# EAGLE schematic silense (EAGLE 9.5.1)
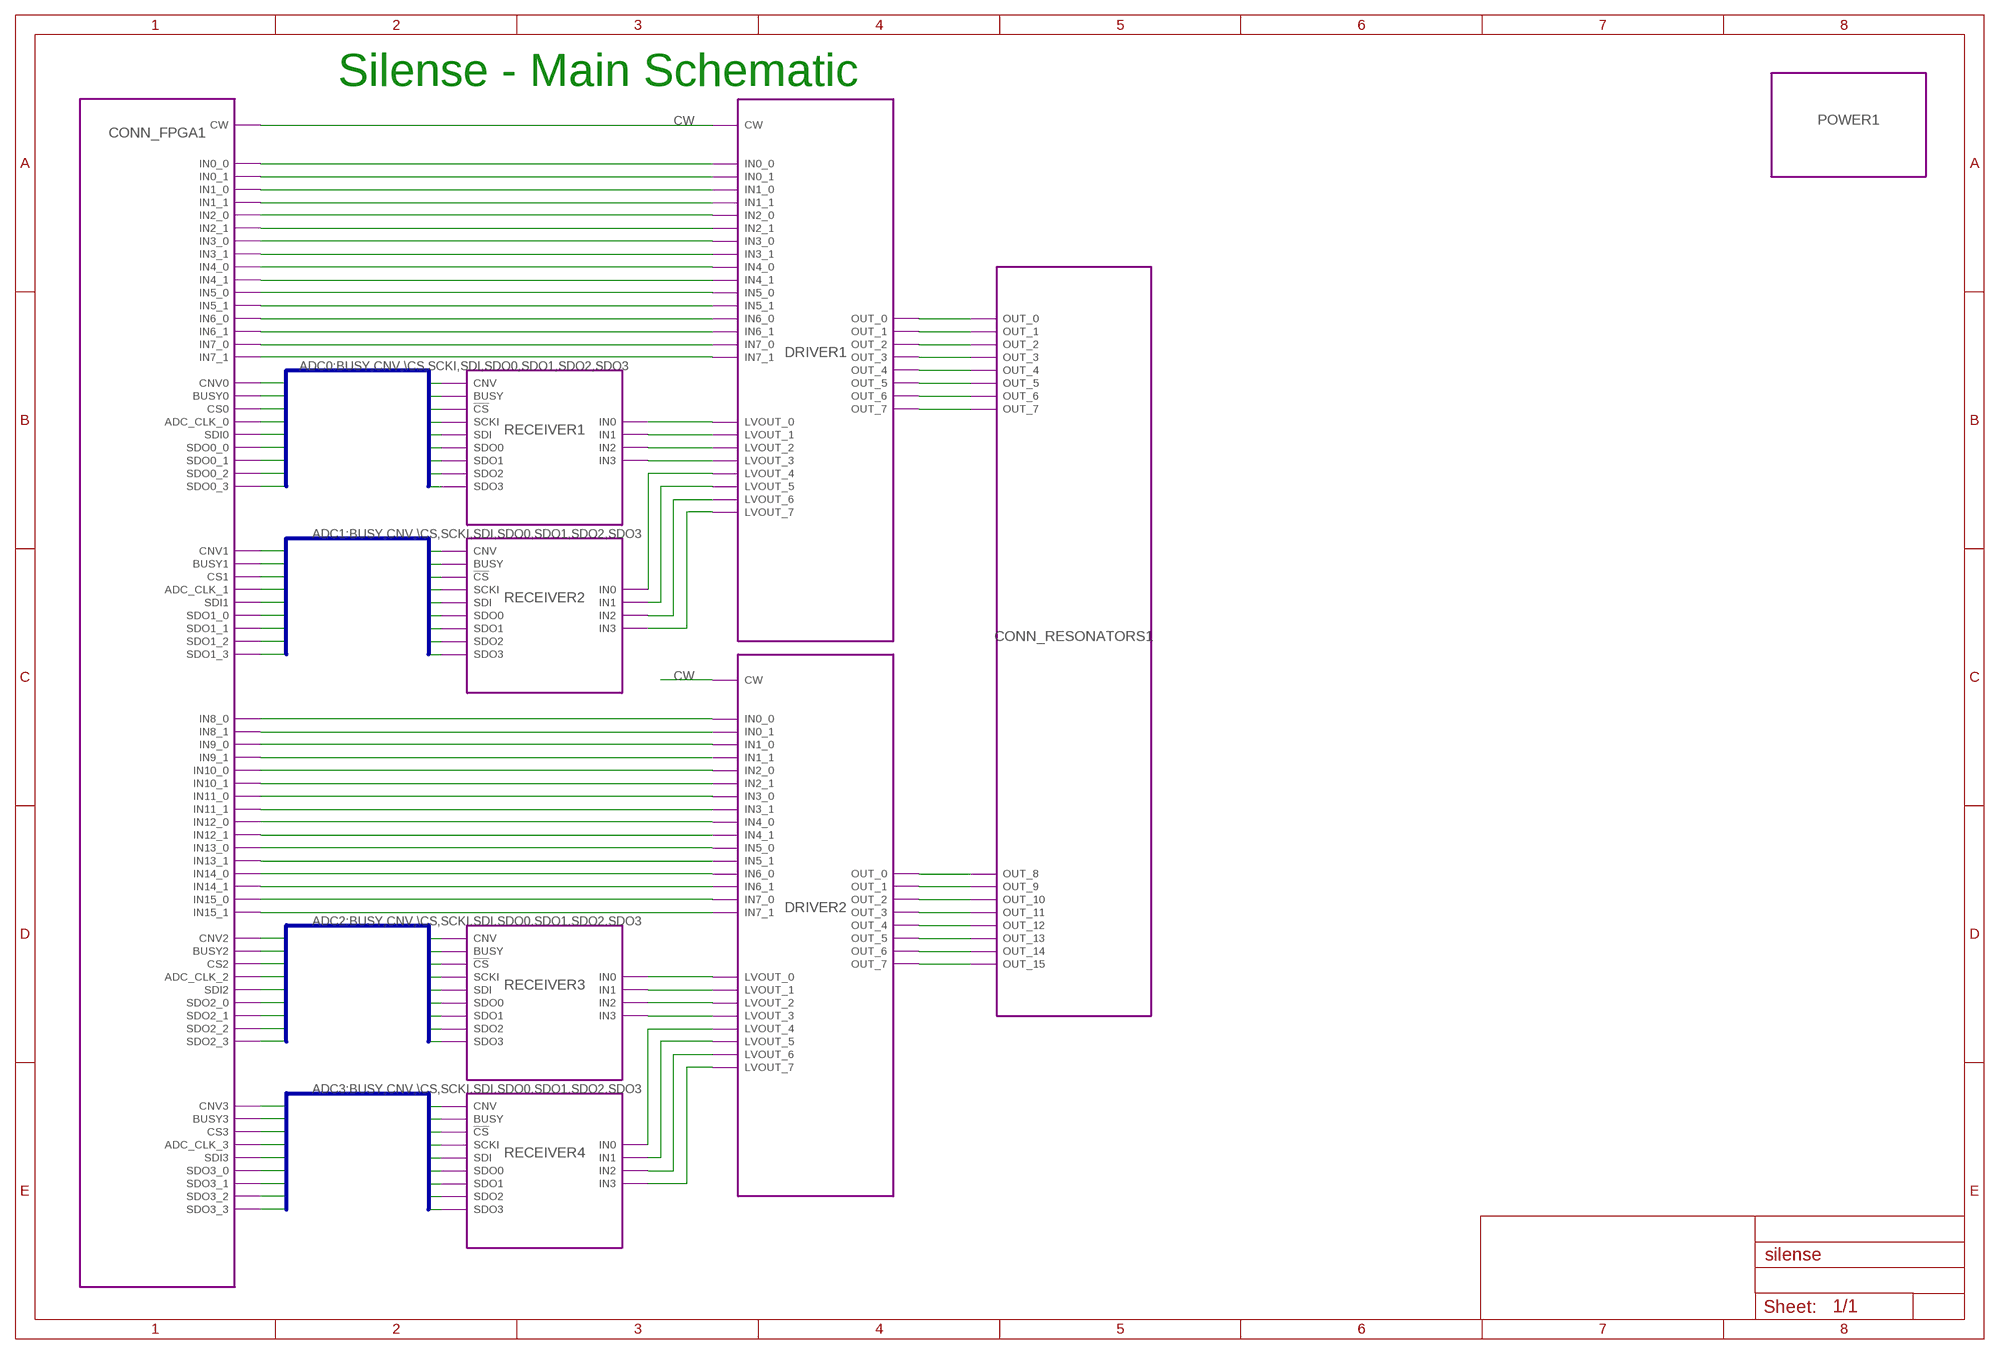
[diagram p0: schematic, sheet 1]

## Module instances
POWER1 = POWER
CONN_FPGA1 = CONN_FPGA
DRIVER1 = DRIVER
DRIVER2 = DRIVER
RECEIVER1 = RECEIVER
RECEIVER2 = RECEIVER
RECEIVER3 = RECEIVER
RECEIVER4 = RECEIVER
CONN_RESONATORS1 = CONN_RESONATORS

## Nets
\CS: port CONN_FPGA1.CS0 RECEIVER1.!CS CONN_FPGA1.CS1 RECEIVER2.!CS CONN_FPGA1.CS2 RECEIVER3.!CS CONN_FPGA1.CS3 RECEIVER4.!CS
BUSY: port CONN_FPGA1.BUSY0 RECEIVER1.BUSY CONN_FPGA1.BUSY1 RECEIVER2.BUSY CONN_FPGA1.BUSY2 RECEIVER3.BUSY CONN_FPGA1.BUSY3 RECEIVER4.BUSY
CNV: port CONN_FPGA1.CNV0 RECEIVER1.CNV CONN_FPGA1.CNV1 RECEIVER2.CNV CONN_FPGA1.CNV2 RECEIVER3.CNV CONN_FPGA1.CNV3 RECEIVER4.CNV
CW: port DRIVER2.CW CONN_FPGA1.CW DRIVER1.CW
N$1: port RECEIVER3.IN3 DRIVER2.LVOUT_3
N$2: port DRIVER2.LVOUT_2 RECEIVER3.IN2
N$3: port RECEIVER3.IN1 DRIVER2.LVOUT_1
N$4: port DRIVER2.LVOUT_0 RECEIVER3.IN0
N$5: port RECEIVER4.IN0 DRIVER2.LVOUT_4
N$6: port DRIVER2.LVOUT_5 RECEIVER4.IN1
N$7: port RECEIVER4.IN2 DRIVER2.LVOUT_6
N$8: port DRIVER2.LVOUT_7 RECEIVER4.IN3
N$9: port DRIVER1.LVOUT_0 RECEIVER1.IN0
N$10: port RECEIVER1.IN1 DRIVER1.LVOUT_1
N$11: port RECEIVER1.IN2 DRIVER1.LVOUT_2
N$12: port RECEIVER1.IN3 DRIVER1.LVOUT_3
N$13: port DRIVER1.LVOUT_4 RECEIVER2.IN0
N$14: port DRIVER1.LVOUT_5 RECEIVER2.IN1
N$15: port RECEIVER2.IN2 DRIVER1.LVOUT_6
N$16: port DRIVER1.LVOUT_7 RECEIVER2.IN3
N$17: port CONN_FPGA1.IN15_1 DRIVER2.IN7_1
N$18: port DRIVER2.IN7_0 CONN_FPGA1.IN15_0
N$19: port CONN_FPGA1.IN14_1 DRIVER2.IN6_1
N$20: port DRIVER2.IN6_0 CONN_FPGA1.IN14_0
N$21: port CONN_FPGA1.IN13_1 DRIVER2.IN5_1
N$22: port DRIVER2.IN5_0 CONN_FPGA1.IN13_0
N$23: port CONN_FPGA1.IN12_1 DRIVER2.IN4_1
N$24: port DRIVER2.IN4_0 CONN_FPGA1.IN12_0
N$25: port CONN_FPGA1.IN11_1 DRIVER2.IN3_1
N$26: port DRIVER2.IN3_0 CONN_FPGA1.IN11_0
N$27: port CONN_FPGA1.IN10_1 DRIVER2.IN2_1
N$28: port DRIVER2.IN2_0 CONN_FPGA1.IN10_0
N$29: port CONN_FPGA1.IN9_1 DRIVER2.IN1_1
N$30: port DRIVER2.IN1_0 CONN_FPGA1.IN9_0
N$31: port CONN_FPGA1.IN8_1 DRIVER2.IN0_1
N$32: port DRIVER2.IN0_0 CONN_FPGA1.IN8_0
N$33: port DRIVER1.IN7_1 CONN_FPGA1.IN7_1
N$34: port CONN_FPGA1.IN7_0 DRIVER1.IN7_0
N$35: port CONN_FPGA1.IN6_1 DRIVER1.IN6_1
N$36: port CONN_FPGA1.IN6_0 DRIVER1.IN6_0
N$37: port CONN_FPGA1.IN5_1 DRIVER1.IN5_1
N$38: port DRIVER1.IN5_0 CONN_FPGA1.IN5_0
N$39: port CONN_FPGA1.IN4_1 DRIVER1.IN4_1
N$40: port DRIVER1.IN4_0 CONN_FPGA1.IN4_0
N$41: port CONN_FPGA1.IN3_1 DRIVER1.IN3_1
N$42: port DRIVER1.IN3_0 CONN_FPGA1.IN3_0
N$43: port CONN_FPGA1.IN2_1 DRIVER1.IN2_1
N$44: port DRIVER1.IN2_0 CONN_FPGA1.IN2_0
N$45: port CONN_FPGA1.IN1_1 DRIVER1.IN1_1
N$46: port CONN_FPGA1.IN1_0 DRIVER1.IN1_0
N$47: port CONN_FPGA1.IN0_1 DRIVER1.IN0_1
N$48: port CONN_FPGA1.IN0_0 DRIVER1.IN0_0
N$49: port DRIVER1.OUT_0 CONN_RESONATORS1.OUT_0
N$50: port DRIVER1.OUT_1 CONN_RESONATORS1.OUT_1
N$51: port DRIVER1.OUT_2 CONN_RESONATORS1.OUT_2
N$52: port DRIVER1.OUT_3 CONN_RESONATORS1.OUT_3
N$53: port DRIVER1.OUT_4 CONN_RESONATORS1.OUT_4
N$54: port DRIVER1.OUT_5 CONN_RESONATORS1.OUT_5
N$55: port DRIVER1.OUT_6 CONN_RESONATORS1.OUT_6
N$56: port DRIVER1.OUT_7 CONN_RESONATORS1.OUT_7
N$57: port DRIVER2.OUT_0 CONN_RESONATORS1.OUT_8
N$58: port DRIVER2.OUT_1 CONN_RESONATORS1.OUT_9
N$59: port DRIVER2.OUT_2 CONN_RESONATORS1.OUT_10
N$60: port DRIVER2.OUT_3 CONN_RESONATORS1.OUT_11
N$61: port DRIVER2.OUT_4 CONN_RESONATORS1.OUT_12
N$62: port DRIVER2.OUT_5 CONN_RESONATORS1.OUT_13
N$63: port DRIVER2.OUT_6 CONN_RESONATORS1.OUT_14
N$64: port DRIVER2.OUT_7 CONN_RESONATORS1.OUT_15
SCKI: port CONN_FPGA1.ADC_CLK_0 RECEIVER1.SCKI CONN_FPGA1.ADC_CLK_1 RECEIVER2.SCKI CONN_FPGA1.ADC_CLK_2 RECEIVER3.SCKI CONN_FPGA1.ADC_CLK_3 RECEIVER4.SCKI
SDI: port CONN_FPGA1.SDI0 RECEIVER1.SDI CONN_FPGA1.SDI1 RECEIVER2.SDI CONN_FPGA1.SDI2 RECEIVER3.SDI CONN_FPGA1.SDI3 RECEIVER4.SDI
SDO0: port CONN_FPGA1.SDO0_0 RECEIVER1.SDO0 CONN_FPGA1.SDO1_0 RECEIVER2.SDO0 CONN_FPGA1.SDO2_0 RECEIVER3.SDO0 CONN_FPGA1.SDO3_0 RECEIVER4.SDO0
SDO1: port CONN_FPGA1.SDO0_1 RECEIVER1.SDO1 CONN_FPGA1.SDO1_1 RECEIVER2.SDO1 CONN_FPGA1.SDO2_1 RECEIVER3.SDO1 CONN_FPGA1.SDO3_1 RECEIVER4.SDO1
SDO2: port CONN_FPGA1.SDO0_2 RECEIVER1.SDO2 CONN_FPGA1.SDO1_2 RECEIVER2.SDO2 CONN_FPGA1.SDO2_2 RECEIVER3.SDO2 CONN_FPGA1.SDO3_2 RECEIVER4.SDO2
SDO3: port CONN_FPGA1.SDO0_3 RECEIVER1.SDO3 CONN_FPGA1.SDO1_3 RECEIVER2.SDO3 CONN_FPGA1.SDO2_3 RECEIVER3.SDO3 CONN_FPGA1.SDO3_3 RECEIVER4.SDO3

## Buses
ADC1:BUSY,CNV,\CS,SCKI,SDI,SDO0,SDO1,SDO2,SDO3
ADC0:BUSY,CNV,\CS,SCKI,SDI,SDO0,SDO1,SDO2,SDO3
ADC2:BUSY,CNV,\CS,SCKI,SDI,SDO0,SDO1,SDO2,SDO3
ADC3:BUSY,CNV,\CS,SCKI,SDI,SDO0,SDO1,SDO2,SDO3

## Notes on the sheet
- Silense - Main Schematic

## Library data of the parts

## Module STHV800
Ports: 
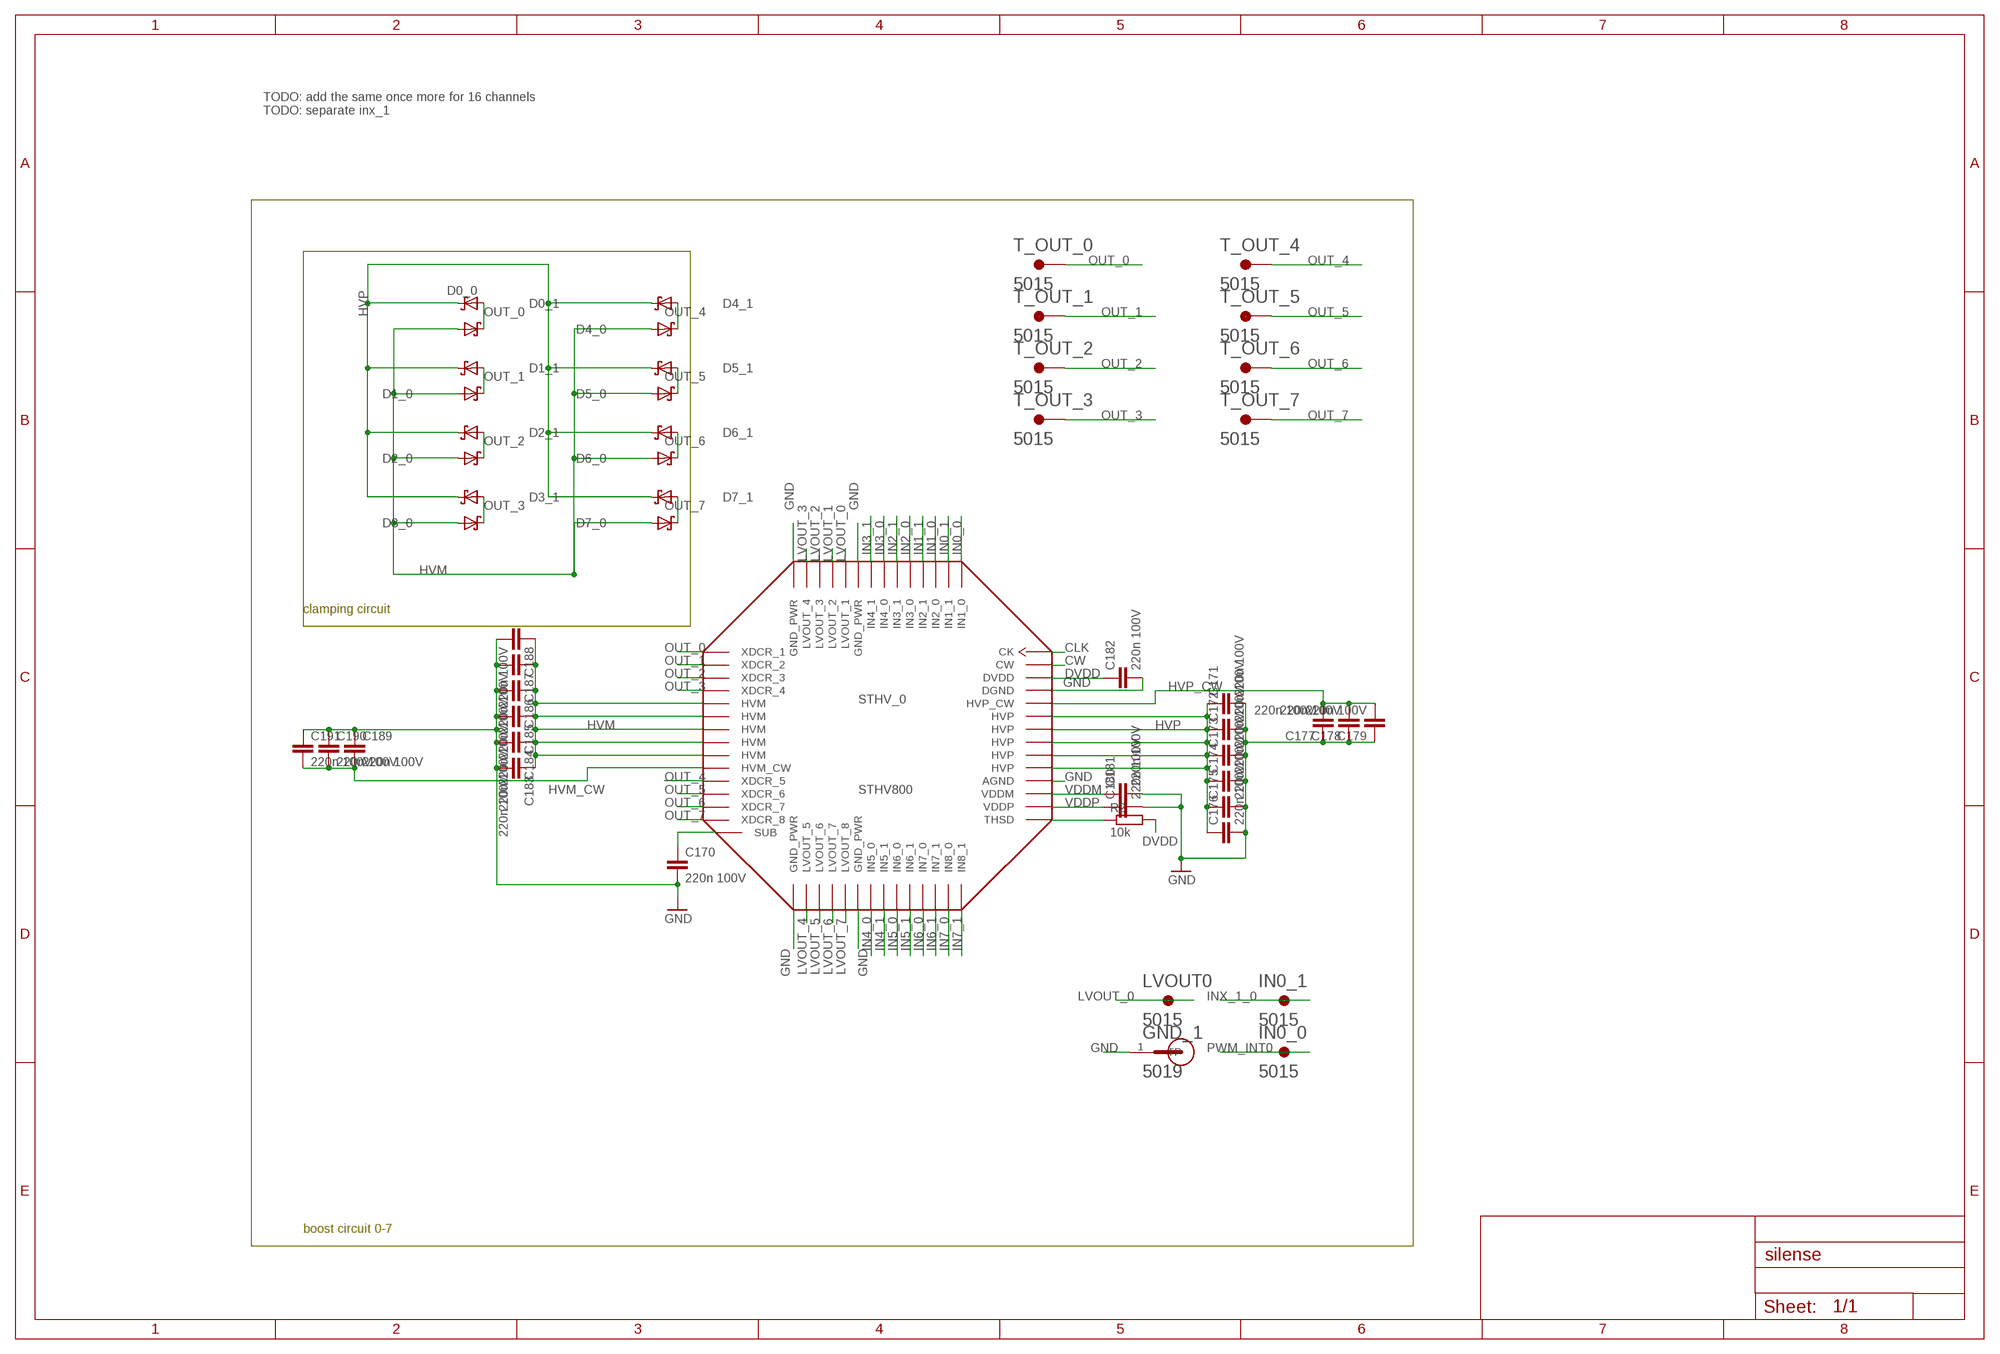
[diagram p1: schematic, module STHV800, sheet 1]

### Parts
C170  220n 100V  C-EUC0805  [C0805]
C171  220n 100V  C-EUC0805  [C0805]
C172  220n 100V  C-EUC0805  [C0805]
C173  220n 100V  C-EUC0805  [C0805]
C174  220n 100V  C-EUC0805  [C0805]
C175  220n 100V  C-EUC0805  [C0805]
C176  220n 100V  C-EUC0805  [C0805]
C177  220n 100V  C-EUC0805  [C0805]
C178  220n 100V  C-EUC0805  [C0805]
C179  220n 100V  C-EUC0805  [C0805]
C180  220n 100V  C-EUC0805  [C0805]
C181  220n 100V  C-EUC0805  [C0805]
C182  220n 100V  C-EUC0805  [C0805]
C183  220n 100V  C-EUC0805  [C0805]
C184  220n 100V  C-EUC0805  [C0805]
C185  220n 100V  C-EUC0805  [C0805]
C186  220n 100V  C-EUC0805  [C0805]
C187  220n 100V  C-EUC0805  [C0805]
C188  220n 100V  C-EUC0805  [C0805]
C189  220n 100V  C-EUC0805  [C0805]
C190  220n 100V  C-EUC0805  [C0805]
C191  220n 100V  C-EUC0805  [C0805]
D0_0  SBR1U200P1SBR1U200P1  [POWERDI-123]
D0_1  SBR1U200P1SBR1U200P1  [POWERDI-123]
D1_0  SBR1U200P1SBR1U200P1  [POWERDI-123]
D1_1  SBR1U200P1SBR1U200P1  [POWERDI-123]
D2_0  SBR1U200P1SBR1U200P1  [POWERDI-123]
D2_1  SBR1U200P1SBR1U200P1  [POWERDI-123]
D3_0  SBR1U200P1SBR1U200P1  [POWERDI-123]
D3_1  SBR1U200P1SBR1U200P1  [POWERDI-123]
D4_0  SBR1U200P1SBR1U200P1  [POWERDI-123]
D4_1  SBR1U200P1SBR1U200P1  [POWERDI-123]
D5_0  SBR1U200P1SBR1U200P1  [POWERDI-123]
D5_1  SBR1U200P1SBR1U200P1  [POWERDI-123]
D6_0  SBR1U200P1SBR1U200P1  [POWERDI-123]
D6_1  SBR1U200P1SBR1U200P1  [POWERDI-123]
D7_0  SBR1U200P1SBR1U200P1  [POWERDI-123]
D7_1  SBR1U200P1SBR1U200P1  [POWERDI-123]
GND_1  5019  [TP380X203]
IN0_0  5015  [KEYSTONE_5015]
IN0_1  5015  [KEYSTONE_5015]
LVOUT0  5015  [KEYSTONE_5015]
R2  10k  R-EU_R0805  [R0805]
STHV_0  STHV800  [TFLGA-56LD]
T_OUT_0  5015  [KEYSTONE_5015]
T_OUT_1  5015  [KEYSTONE_5015]
T_OUT_2  5015  [KEYSTONE_5015]
T_OUT_3  5015  [KEYSTONE_5015]
T_OUT_4  5015  [KEYSTONE_5015]
T_OUT_5  5015  [KEYSTONE_5015]
T_OUT_6  5015  [KEYSTONE_5015]
T_OUT_7  5015  [KEYSTONE_5015]

### Nets
CLK: STHV_0.CK
CW: STHV_0.CW
DVDD: C182.1 R2.2 STHV_0.DVDD
GND [power]: C170.2 C171.2 C172.2 C173.2 C174.2 C175.2 C176.2 C177.1 C178.1 C179.1 C180.2 C181.2 C182.2 C183.2 C184.2 C185.2 C186.2 C187.2 C188.2 C189.1 C190.1 C191.1 GND_1.1(TP) STHV_0.AGND STHV_0.DGND STHV_0.GND_PWR@1(GND_PWR) STHV_0.GND_PWR@2(GND_PWR) STHV_0.GND_PWR@3(GND_PWR) STHV_0.GND_PWR@4(GND_PWR)
HVM: C183.1 C184.1 C185.1 C186.1 C187.1 C188.1 D0_1.A D1_1.A D2_1.A D3_1.A D4_1.A D5_1.A D6_1.A D7_1.A STHV_0.HVM@1(HVM) STHV_0.HVM@2(HVM) STHV_0.HVM@3(HVM) STHV_0.HVM@4(HVM) STHV_0.HVM@5(HVM)
HVM_CW: C189.2 C190.2 C191.2 STHV_0.HVM_CW
HVP [power]: C171.1 C172.1 C173.1 C174.1 C175.1 C176.1 D0_0.C D1_0.C D2_0.C D3_0.C D4_0.C D5_0.C D6_0.C D7_0.C STHV_0.HVP@1(HVP) STHV_0.HVP@2(HVP) STHV_0.HVP@3(HVP) STHV_0.HVP@4(HVP) STHV_0.HVP@5(HVP)
HVP_CW: C177.2 C178.2 C179.2 STHV_0.HVP_CW
IN0_0: STHV_0.IN1_0
IN0_1: STHV_0.IN1_1
IN1_0: STHV_0.IN2_0
IN1_1: STHV_0.IN2_1
IN2_0: STHV_0.IN3_0
IN2_1: STHV_0.IN3_1
IN3_0: STHV_0.IN4_0
IN3_1: STHV_0.IN4_1
IN4_0: STHV_0.IN5_0
IN4_1: STHV_0.IN5_1
IN5_0: STHV_0.IN6_0
IN5_1: STHV_0.IN6_1
IN6_0: STHV_0.IN7_0
IN6_1: STHV_0.IN7_1
IN7_0: STHV_0.IN8_0
IN7_1: STHV_0.IN8_1
INX_1_0: IN0_1.1(TP)
LVOUT_0: LVOUT0.1(TP) STHV_0.LVOUT_1
LVOUT_1: STHV_0.LVOUT_2
LVOUT_2: STHV_0.LVOUT_3
LVOUT_3: STHV_0.LVOUT_4
LVOUT_4: STHV_0.LVOUT_5
LVOUT_5: STHV_0.LVOUT_6
LVOUT_6: STHV_0.LVOUT_7
LVOUT_7: STHV_0.LVOUT_8
N$23: R2.1 STHV_0.THSD
N$24: C170.1 STHV_0.SUB
OUT_0: D0_0.A D0_1.C STHV_0.XDCR_1 T_OUT_0.1(TP)
OUT_1: D1_0.A D1_1.C STHV_0.XDCR_2 T_OUT_1.1(TP)
OUT_2: D2_0.A D2_1.C STHV_0.XDCR_3 T_OUT_2.1(TP)
OUT_3: D3_0.A D3_1.C STHV_0.XDCR_4 T_OUT_3.1(TP)
OUT_4: D4_0.A D4_1.C STHV_0.XDCR_5 T_OUT_4.1(TP)
OUT_5: D5_0.A D5_1.C STHV_0.XDCR_6 T_OUT_5.1(TP)
OUT_6: D6_0.A D6_1.C STHV_0.XDCR_7 T_OUT_6.1(TP)
OUT_7: D7_0.A D7_1.C STHV_0.XDCR_8 T_OUT_7.1(TP)
PWM_INT0: IN0_0.1(TP)
VDDM: C181.1 STHV_0.VDDM
VDDP: C180.1 STHV_0.VDDP

### Notes on the sheet
- TODO: add the same once more for 16 channels
  TODO: separate inx_1
- clamping circuit
- boost circuit 0-7

### Library data of the parts
C170-C191 = rcl:C-EU: CAPACITOR, European symbol; SPICEPREFIX: C
D0_0 D0_1 D1_0 D1_1 D2_0 D2_1 D3_0 D3_1 D4_0 D4_1 D5_0 D5_1 D6_0 D6_1 D7_0 D7_1 = dfls130l-7:SBR1U200P1: Super Barrier Rectifier Diode; MF: Diodes Inc; MOUSER: SBR1U200P1-7; MPN: SBR1U200P1
GND_1 = 5019:5019: Test Point, Compact, Surface Mount; AVAILABILITY: Good; DESCRIPTION: Phosphor Bronze Contact Miniature Silver Plated Surface Mount Test Points; MF: Keystone; MP: 5019; PACKAGE: 2010 Keystone; PRICE: 0.18 USD
IN0_0 IN0_1 LVOUT0 T_OUT_0 T_OUT_1-T_OUT_7 = keystone_5015:5015: Test Point; Black; Surface Mount; Wire Leaded; Polycarbonate; 0.04 in.; AVAILABILITY: Unavailable; DESCRIPTION: Test Point; Black; Surface Mount; Wire Leaded; Polycarbonate; 0.04 in.; MF: Keystone Electronics; MP: 5015; PACKAGE: Keystone Electronics; PRICE: None
R2 = rcl:R-EU_: RESISTOR, European symbol
STHV_0 = wouter:STHV800

## Module AD8334
Ports: OUT_A_P(out) OUT_A_N(out) OUT_B_P(out) OUT_B_N(out) IN_A(in) IN_B(in) OUT_A_VCM(out) OUT_B_VCM(out)
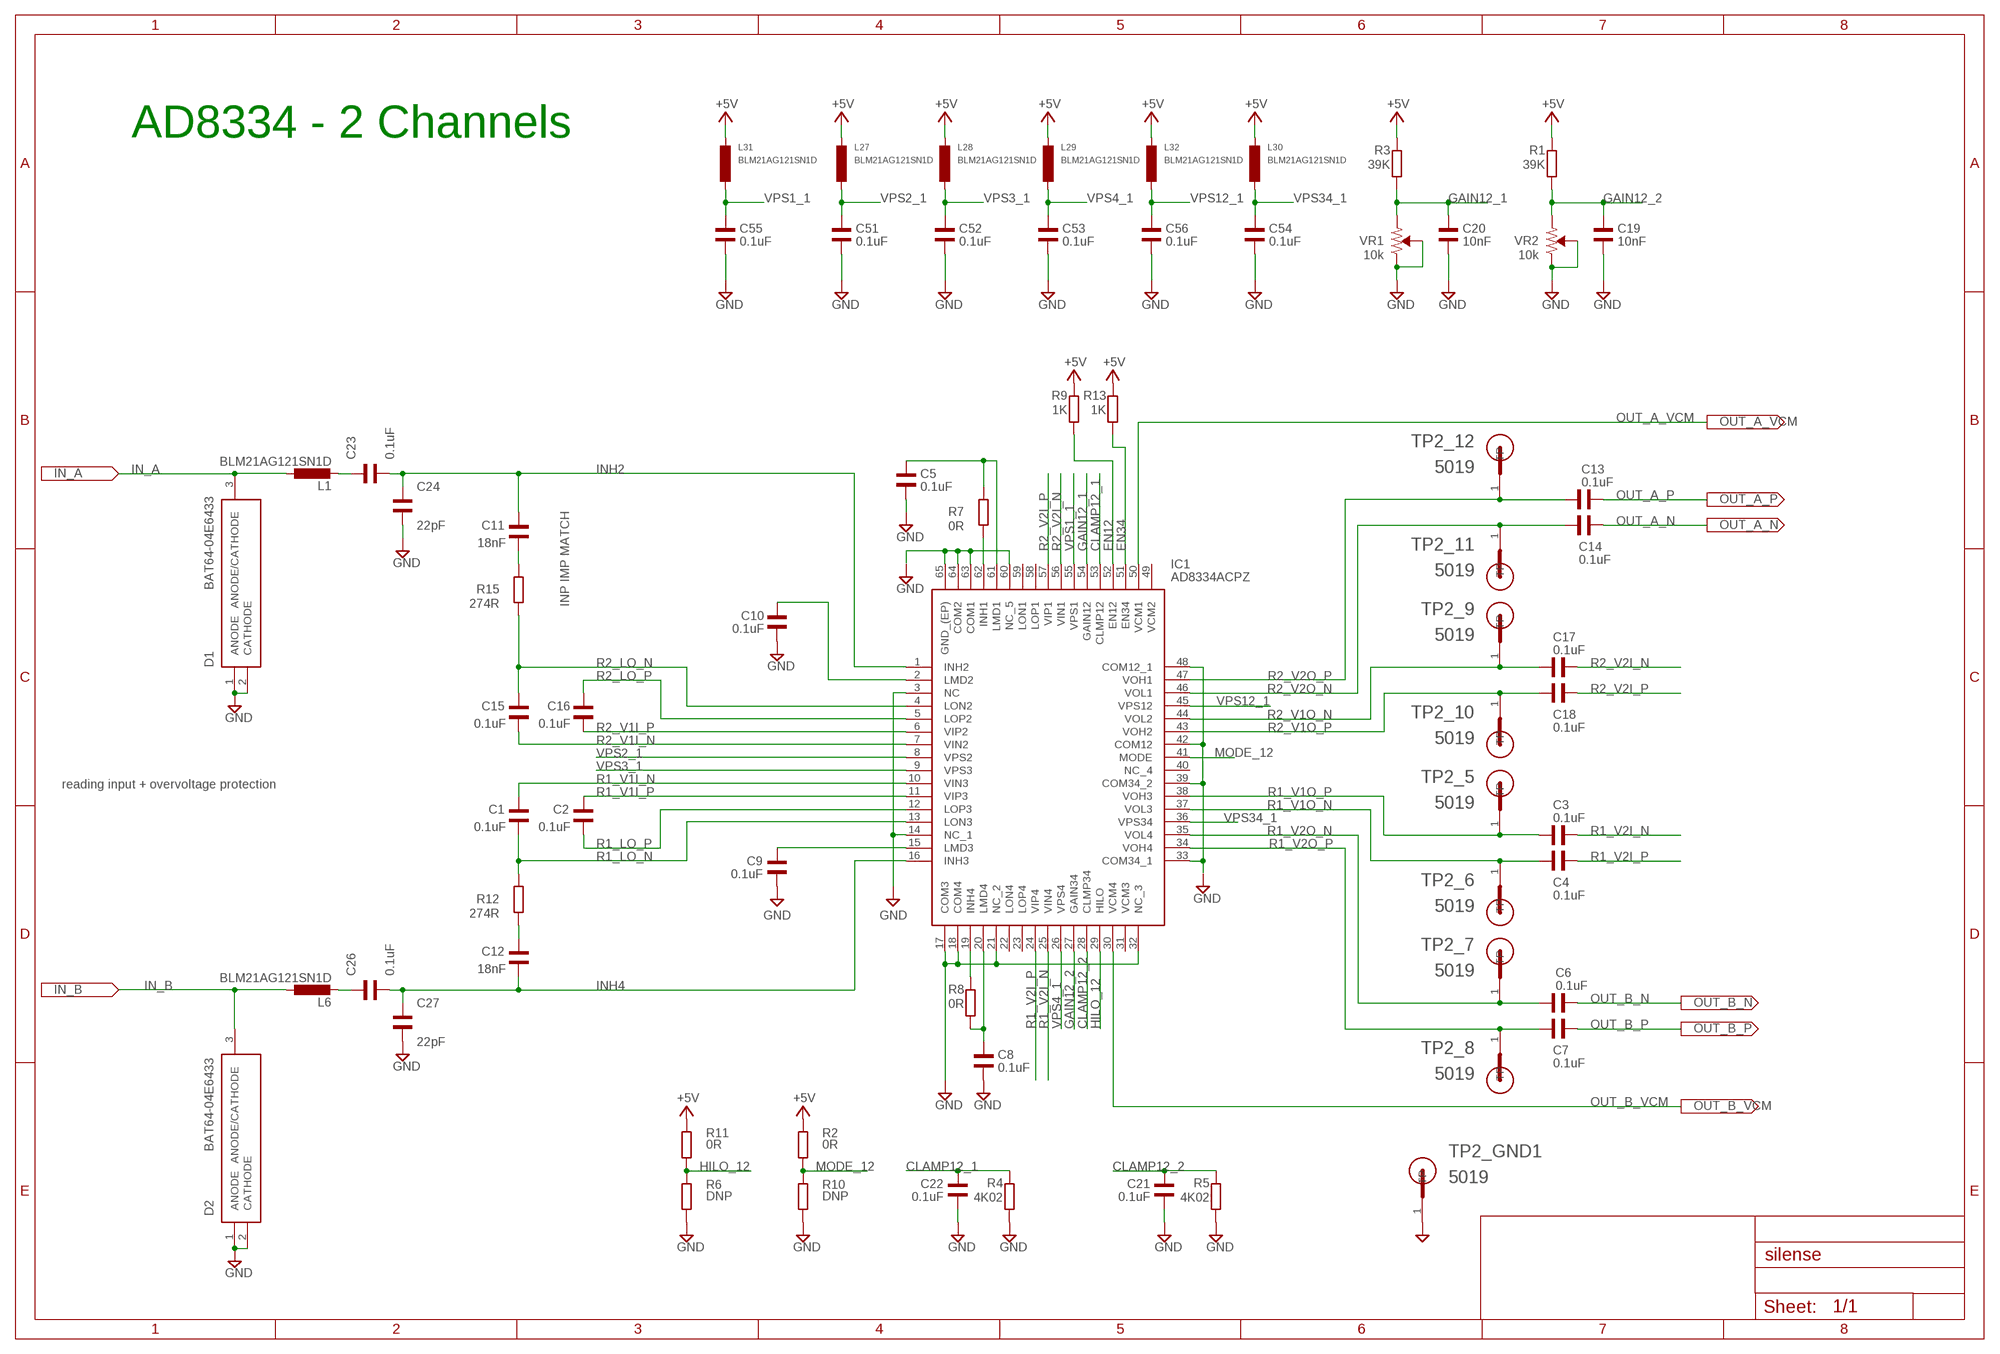
[diagram p2: schematic, module AD8334, sheet 1]
SUPPLY5 (V-->): NET: IN_A
SUPPLY8 (V-->): NET: IN_B
SUPPLY9 (V-->): NET: OUT_A_VCM
SUPPLY10 (V-->): NET: OUT_B_VCM
SUPPLY15 (V-->): NET: OUT_A_P
SUPPLY16 (V-->): NET: OUT_A_N
SUPPLY17 (V-->): NET: OUT_B_N
SUPPLY18 (V-->): NET: OUT_B_P

### Parts
C1  0.1uF  WCAP-CSGP_0402_885012205037  [WCAP-CSGP_0402]
C2  0.1uF  WCAP-CSGP_0402_885012205037  [WCAP-CSGP_0402]
C3  0.1uF  WCAP-CSGP_0402_885012205037  [WCAP-CSGP_0402]
C4  0.1uF  WCAP-CSGP_0402_885012205037  [WCAP-CSGP_0402]
C5  0.1uF  WCAP-CSGP_0402_885012205037  [WCAP-CSGP_0402]
C6  0.1uF  WCAP-CSGP_0402_885012205037  [WCAP-CSGP_0402]
C7  0.1uF  WCAP-CSGP_0402_885012205037  [WCAP-CSGP_0402]
C8  0.1uF  WCAP-CSGP_0402_885012205037  [WCAP-CSGP_0402]
C9  0.1uF  WCAP-CSGP_0402_885012205037  [WCAP-CSGP_0402]
C10  0.1uF  WCAP-CSGP_0402_885012205037  [WCAP-CSGP_0402]
C11  18nF  WCAP-CSGP_0402_885012205037  [WCAP-CSGP_0402]
C12  18nF  WCAP-CSGP_0402_885012205037  [WCAP-CSGP_0402]
C13  0.1uF  WCAP-CSGP_0402_885012205037  [WCAP-CSGP_0402]
C14  0.1uF  WCAP-CSGP_0402_885012205037  [WCAP-CSGP_0402]
C15  0.1uF  WCAP-CSGP_0402_885012205037  [WCAP-CSGP_0402]
C16  0.1uF  WCAP-CSGP_0402_885012205037  [WCAP-CSGP_0402]
C17  0.1uF  WCAP-CSGP_0402_885012205037  [WCAP-CSGP_0402]
C18  0.1uF  WCAP-CSGP_0402_885012205037  [WCAP-CSGP_0402]
C19  10nF  WCAP-CSGP_0402_885012205037  [WCAP-CSGP_0402]
C20  10nF  WCAP-CSGP_0402_885012205037  [WCAP-CSGP_0402]
C21  0.1uF  WCAP-CSGP_0402_885012205037  [WCAP-CSGP_0402]
C22  0.1uF  WCAP-CSGP_0402_885012205037  [WCAP-CSGP_0402]
C23  0.1uF  WCAP-CSGP_0402_885012205037  [WCAP-CSGP_0402]
C24  22pF  WCAP-CSGP_0402_885012005009  [WCAP-CSGP_0402]
C26  0.1uF  WCAP-CSGP_0402_885012205037  [WCAP-CSGP_0402]
C27  22pF  WCAP-CSGP_0402_885012005009  [WCAP-CSGP_0402]
C51  0.1uF  WCAP-CSGP_0402_885012205037  [WCAP-CSGP_0402]
C52  0.1uF  WCAP-CSGP_0402_885012205037  [WCAP-CSGP_0402]
C53  0.1uF  WCAP-CSGP_0402_885012205037  [WCAP-CSGP_0402]
C54  0.1uF  WCAP-CSGP_0402_885012205037  [WCAP-CSGP_0402]
C55  0.1uF  WCAP-CSGP_0402_885012205037  [WCAP-CSGP_0402]
C56  0.1uF  WCAP-CSGP_0402_885012205037  [WCAP-CSGP_0402]
D1  BAT64-04E6433  [SOT95P260X110-3N]
D2  BAT64-04E6433  [SOT95P260X110-3N]
IC1  AD8334ACPZ  [QFN50P900X900X100-65N]
L1  BLM21AG121SN1D  L-EUL2012C  [L2012C]
L6  BLM21AG121SN1D  L-EUL2012C  [L2012C]
L27  BLM21AG121SN1D  L-EUL2012C  [L2012C]
L28  BLM21AG121SN1D  L-EUL2012C  [L2012C]
L29  BLM21AG121SN1D  L-EUL2012C  [L2012C]
L30  BLM21AG121SN1D  L-EUL2012C  [L2012C]
L31  BLM21AG121SN1D  L-EUL2012C  [L2012C]
L32  BLM21AG121SN1D  L-EUL2012C  [L2012C]
R1  39K  R-EU_R0402  [R0402]
R2  0R  R-EU_R0402  [R0402]
R3  39K  R-EU_R0402  [R0402]
R4  4K02  R-EU_R0402  [R0402]
R5  4K02  R-EU_R0402  [R0402]
R6  DNP  R-EU_R0402  [R0402]
R7  0R  R-EU_R0402  [R0402]
R8  0R  R-EU_R0402  [R0402]
R9  1K  R-EU_R0402  [R0402]
R10  DNP  R-EU_R0402  [R0402]
R11  0R  R-EU_R0402  [R0402]
R12  274R  R-EU_R0402  [R0402]
R13  1K  R-EU_R0402  [R0402]
R15  274R  R-EU_R0402  [R0402]
TP2_5  5019  [TP380X203]
TP2_6  5019  [TP380X203]
TP2_7  5019  [TP380X203]
TP2_8  5019  [TP380X203]
TP2_9  5019  [TP380X203]
TP2_10  5019  [TP380X203]
TP2_11  5019  [TP380X203]
TP2_12  5019  [TP380X203]
TP2_GND1  5019  [TP380X203]
VR1  10k  TRIMPOT-SMD-3MM-OPEN-1/10W-25%  [TRIMPOT-SMD-TC33X]
VR2  10k  TRIMPOT-SMD-3MM-OPEN-1/10W-25%  [TRIMPOT-SMD-TC33X]

### Nets
+5V [power]: L27.1 L28.1 L29.1 L30.1 L31.1 L32.1 R1.2 R2.2 R3.2 R9.2 R11.2 R13.2
CLAMP12_1: C22.1 IC1.53(CLMP12) R4.2
CLAMP12_2: C21.1 IC1.28(CLMP34) R5.2
EN12: IC1.52(EN12) R9.1
EN34: IC1.51(EN34) R13.1
GAIN12_1: C20.1 IC1.54(GAIN12) R3.1 VR1.3(CCW)
GAIN12_2: C19.1 IC1.27(GAIN34) R1.1 VR2.3(CCW)
GND [power]: C5.2 C8.1 C9.1 C10.1 C19.2 C20.2 C21.2 C22.2 C24.1 C27.1 C51.1 C52.1 C53.1 C54.1 C55.1 C56.1 D1.1(ANODE) D1.2(CATHODE) D2.1(ANODE) D2.2(CATHODE) IC1.3(NC) IC1.14(NC_1) IC1.17(COM3) IC1.18(COM4) IC1.21(NC_2) IC1.32(NC_3) IC1.60(NC_5) IC1.63(COM1) IC1.64(COM2) IC1.65(GND_(EP)) R4.1 R5.1 R6.1 R10.1 TP2_GND1.1(TP) VR1.1(CW) VR1.2(WIPER) VR2.1(CW) VR2.2(WIPER)
HILO_12: IC1.29(HILO) R6.2 R11.1
IN_A: D1.3(ANODE/CATHODE) L1.1
IN_B [power]: D2.3(ANODE/CATHODE) L6.1
INH2: C11.2 C23.1 C24.2 IC1.1(INH2)
INH4: C12.1 C26.1 C27.2 IC1.16(INH3)
MODE_12: IC1.41(MODE) R2.1 R10.2
N$1: C5.1 IC1.61(LMD1) R7.2
N$2: C8.2 IC1.20(LMD4) R8.1
N$4 [power]: IC1.33(COM34_1) IC1.39(COM34_2) IC1.42(COM12) IC1.48(COM12_1)
N$5: C10.2 IC1.2(LMD2)
N$6: C9.2 IC1.15(LMD3)
N$11: C23.2 L1.2
N$12: C11.1 R15.2
N$13: C26.2 L6.2
N$14: C12.2 R12.1
N$15: IC1.19(INH4) R8.2
OUT_A_N: C14.2
OUT_A_P: C13.2
OUT_A_VCM: IC1.50(VCM1)
OUT_B_N: C6.2
OUT_B_P: C7.2
OUT_B_VCM: IC1.30(VCM4)
R1_I: IC1.62(INH1) R7.1
R1_LO_N: C1.1 IC1.13(LON3) R12.2
R1_LO_P: C2.1 IC1.12(LOP3)
R1_V1I_N: C1.2 IC1.10(VIN3)
R1_V1I_P: C2.2 IC1.11(VIP3)
R1_V1O_N: C4.1 IC1.37(VOL3) TP2_6.1(TP)
R1_V1O_P: C3.1 IC1.38(VOH3) TP2_5.1(TP)
R1_V2I_N: C3.2 IC1.25(VIN4)
R1_V2I_P: C4.2 IC1.24(VIP4)
R1_V2O_N: C6.1 IC1.35(VOL4) TP2_7.1(TP)
R1_V2O_P: C7.1 IC1.34(VOH4) TP2_8.1(TP)
R2_LO_N: C15.2 IC1.4(LON2) R15.1
R2_LO_P: C16.2 IC1.5(LOP2)
R2_V1I_N: C15.1 IC1.7(VIN2)
R2_V1I_P: C16.1 IC1.6(VIP2)
R2_V1O_N: C17.1 IC1.44(VOL2) TP2_9.1(TP)
R2_V1O_P: C18.1 IC1.43(VOH2) TP2_10.1(TP)
R2_V2I_N: C17.2 IC1.56(VIN1)
R2_V2I_P: C18.2 IC1.57(VIP1)
R2_V2O_N: C14.1 IC1.46(VOL1) TP2_11.1(TP)
R2_V2O_P: C13.1 IC1.47(VOH1) TP2_12.1(TP)
VPS1_1: C55.2 IC1.55(VPS1) L31.2
VPS2_1: C51.2 IC1.8(VPS2) L27.2
VPS3_1: C52.2 IC1.9(VPS3) L28.2
VPS4_1: C53.2 IC1.26(VPS4) L29.2
VPS12_1: C56.2 IC1.45(VPS12) L32.2
VPS34_1: C54.2 IC1.36(VPS34) L30.2
Unconnected: IC1.22(LON4) IC1.23(LOP4) IC1.31(VCM3) IC1.40(NC_4) IC1.49(VCM2) IC1.58(LOP1) IC1.59(LON1)

### Notes on the sheet
- AD8334 - 2 Channels
- INP IMP MATCH
- reading input + overvoltage protection

### Library data of the parts
C1-C24 C26 C27 C51-C56 = Wurth_Elektronik_Passive_Capacitors_rev18b:WCAP-CSGP_0402: WCAP-CSGP Ceramic Capacitors Characteristics Multilayer Ceramic Chip Capacitor Recommended soldering:Reflow, for 0603 and 0805 wave soldering is also allowed Operating temperature:-55 °C to +125 °C; Ceramic characteristics: Class I - NPO ; Class II -X7R, X5R High performance ceramic High capacitance stability Minimal aging Termination:Cu/Ni/Sn <http://katalog.we-online.de/media/images/eisos/WCAP-CSGP_pf2.jpg> Details see: http://katalog.we-online.de/en/pbs/WCAP-CSGP-0402? Created: 2015-01-28 2015 (C) Wurth Elektronik
D1 D2 = BAT64-04E6433:BAT64-04E6433: Infineon BAT64-04E6433, Dual SMT Schottky Fast Recovery Diode, Series, 40V 250mA, 5ns, 3-Pin SOT-23 Source: Datasheet <https://www.infineon.com/dgdl/Infineon-BAT64SERIES-DS-v01_01-en.pdf?fileId=db3a304314dca3890115191757980ead>; DESCRIPTION: Infineon BAT64-04E6433, Dual SMT Schottky Fast Recovery Diode, Series, 40V 250mA, 5ns, 3-Pin SOT-23; HEIGHT: 1.1mm; MANUFACTURER_NAME: Infineon; MANUFACTURER_PART_NUMBER: BAT64-04E6433
IC1 = AD8334ACPZ:AD8334ACPZ: AD8334ACPZ, Programmable Gain Amplifier 4, 64-Pin LFCSP VQ Source: Datasheet <http://docs-emea.rs-online.com/webdocs/12fa/0900766b812fac01.pdf>; DESCRIPTION: AD8334ACPZ, Programmable Gain Amplifier 4, 64-Pin LFCSP VQ; HEIGHT: 1mm; MANUFACTURER_NAME: Analog Devices; MANUFACTURER_PART_NUMBER: AD8334ACPZ; MOUSER_PART_NUMBER: 584-AD8334ACPZ; MOUSER_PRICE-STOCK: https://www.mouser.com/Search/Refine.aspx?Keyword=584-AD8334ACPZ; RS_PART_NUMBER: 8099263P; RS_PRICE-STOCK: http://uk.rs-online.com/web/p/products/8099263P
L1 L6 = rcl:L-EU: INDUCTOR, European symbol; SPICEPREFIX: L
L27-L32 = resistor:L-EU: INDUCTOR, European symbol
R1-R13 R15 = resistor:R-EU_: RESISTOR, European symbol
TP2_5-TP2_12 TP2_GND1 = 5019:5019: Test Point, Compact, Surface Mount; AVAILABILITY: Good; DESCRIPTION: Phosphor Bronze Contact Miniature Silver Plated Surface Mount Test Points; MF: Keystone; MP: 5019; PACKAGE: 2010 Keystone; PRICE: 0.18 USD
VR1 VR2 = SparkFun-Resistors:TRIMPOT: Trimming Potentiometer (Trimpot) Three-terminal potentiometers, with an adjustable wiper and two adjustable resistors. A pot can be used to create a configurable voltage divider, or as a variable resistor. "Trimpots" are a subset of potentiometers, usually intended for "set-and-forget" applications. They're often more delicate than standard potentiometers - rated for fewer turns. Variants PTH-KNOB - PTH Trimpot w/ finger-adjustable knob Trimpot 10K with Knob <https://www.sparkfun.com/products/9806> (COM-09806) Datasheet <http://www.sparkfun.com/datasheets/Components/General/TSR-3386.pdf> SMD-3MM-CLOSED-FRAME - SMD 3mm Square Closed-Frame Trimpot Used on e.g. EasyDriver - Stepper Motor Driver <https://www.sparkfun.com/products/12779> Datasheet <http://www.bitechnologies.com/pdfs/22.pdf> (22AR10KTR) SMD-5MM - SMD 5mm Square Closed-Frame Trimpot Used on e.g. IOIO-OTG - V2.2 <https://www.sparkfun.com/products/13613> Datasheet <http://www.vishay.com/docs/51008/ts53.pdf> (TS53YL502MR10) SMD-3MM-1/10W-25% - 3mm Square Open-Frame Trimpot Used on e.g. SparkFun Shapeoko <https://www.sparkfun.com/products/13899> Datasheet <http://www.bourns.com/docs/Product-Datasheets/TC33.pdf> (TC33X-2-103E); PROD_ID: RES-12428

## Module ENVELOPE
Ports: IN_1(in) IN_2(in) OUT_2(out) OUT_1(out) VCOM(in)
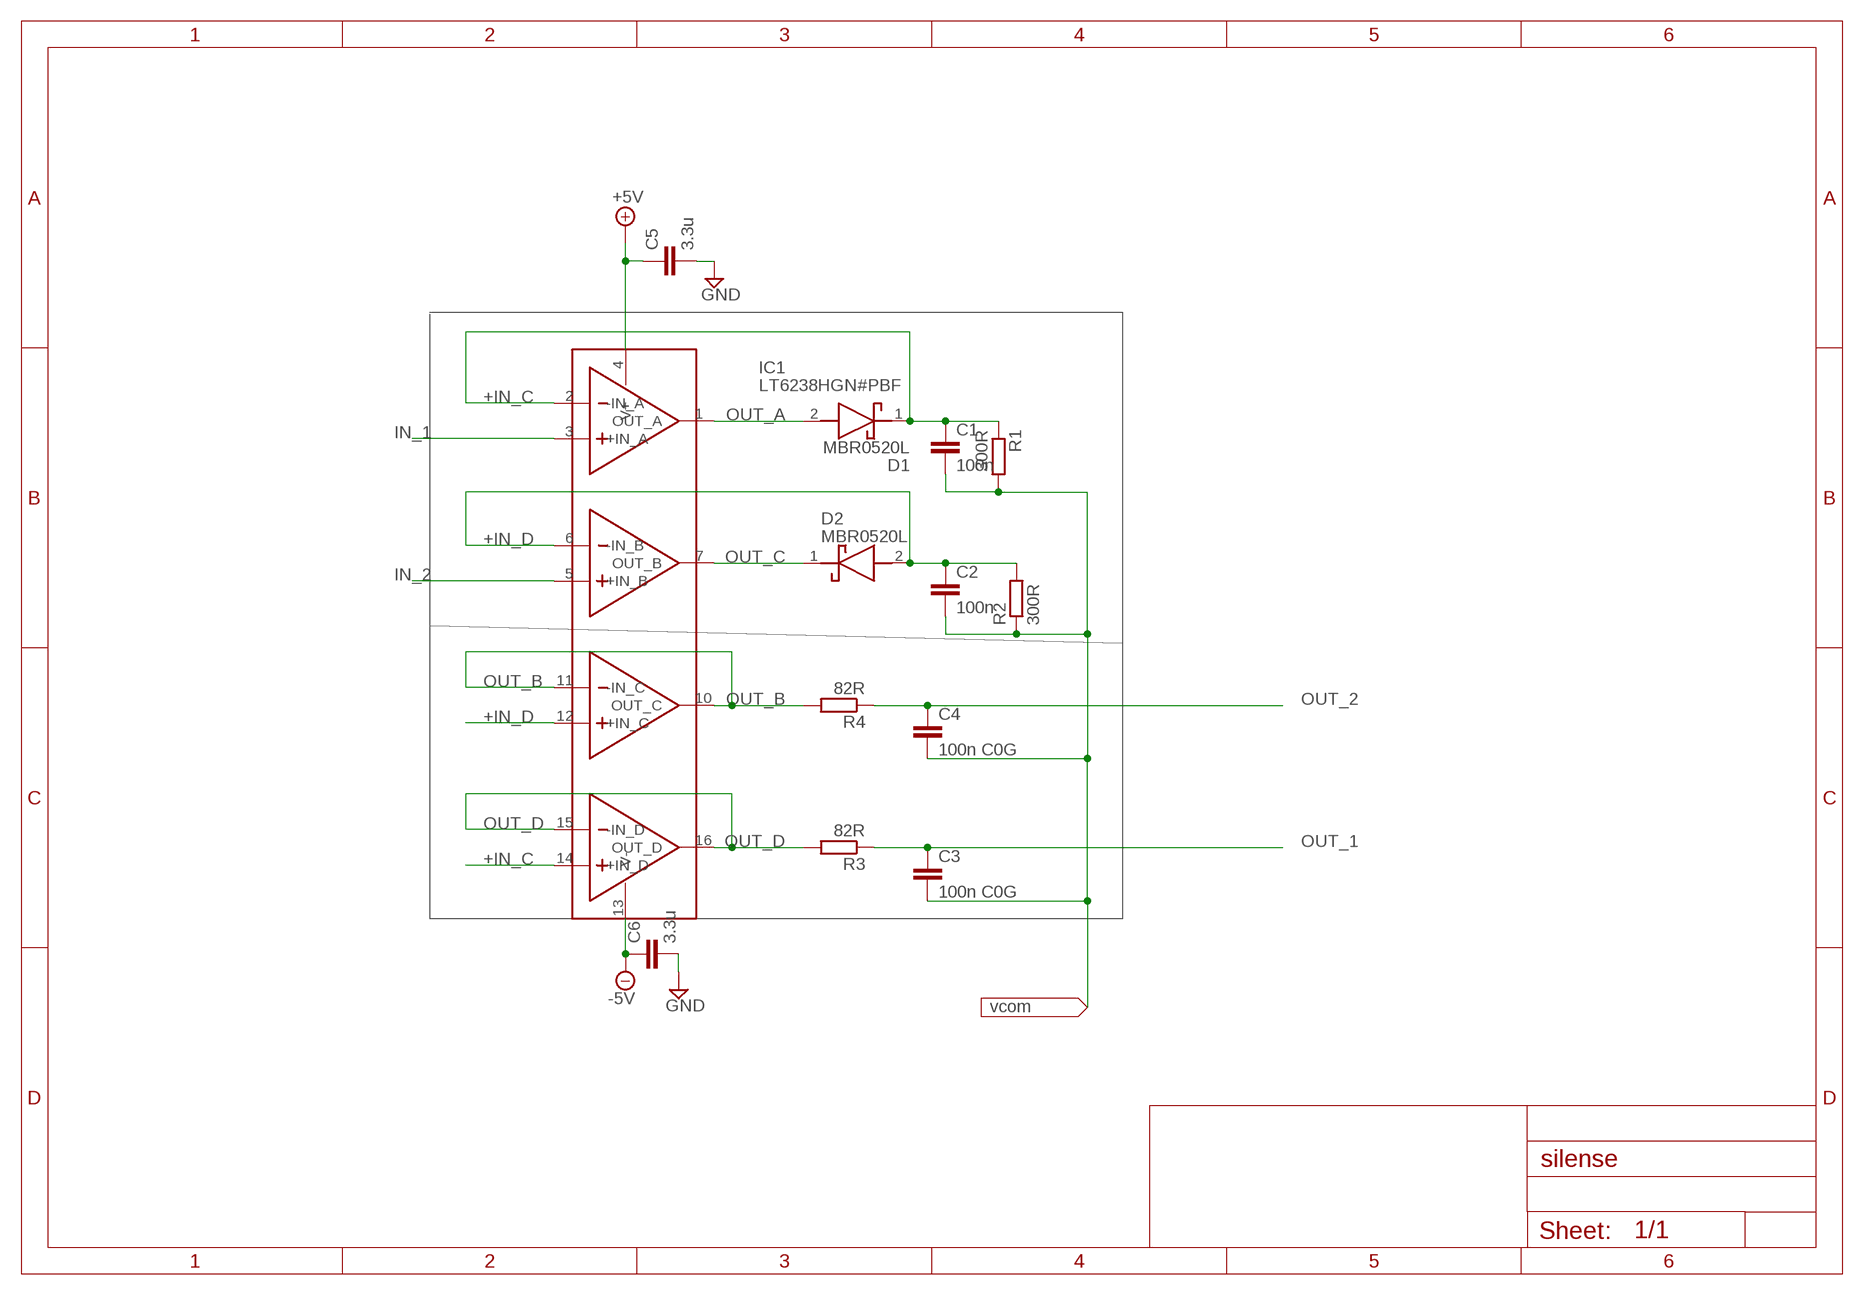
[diagram p3: schematic, module ENVELOPE, sheet 1]

### Parts
C1  100n  C-EUC0603  [C0603]
C2  100n  C-EUC0603  [C0603]
C3  100n C0G  C-EUC1206  [C1206]
C4  100n C0G  C-EUC1206  [C1206]
C5  3.3u  C-EUC0402  [C0402]
C6  3.3u  C-EUC0402  [C0402]
D1  MBR0520L  [SOD3816X128N]
D2  MBR0520L  [SOD3816X128N]
IC1  LT6238HGN#PBF  [SOP64P601X175-16N]
R1  300R  R-EU_M0805  [M0805]
R2  300R  R-EU_M0805  [M0805]
R3  82R  R-EU_M0805  [M0805]
R4  82R  R-EU_M0805  [M0805]

### Nets
+5V: C5.1 IC1.4(V+)
+IN_C: C1.1 D1.1(K) IC1.2(-IN_A) IC1.14(+IN_D) R1.1
+IN_D: C2.1 D2.2(A) IC1.6(-IN_B) IC1.12(+IN_C) R2.2
-5V: C6.1 IC1.13(V-)
GND: C5.2 C6.2
IN_1: IC1.3(+IN_A)
IN_2: IC1.5(+IN_B)
OUT_1: C3.1 R3.1
OUT_2: C4.1 R4.1
OUT_A: D1.2(A) IC1.1(OUT_A)
OUT_B: IC1.10(OUT_C) IC1.11(-IN_C) R4.2
OUT_C: D2.1(K) IC1.7(OUT_B)
OUT_D: IC1.15(-IN_D) IC1.16(OUT_D) R3.2
VCOM: C1.2 C2.2 C3.2 C4.2 R1.2 R2.1

### Library data of the parts
C1-C6 = rcl:C-EU: CAPACITOR, European symbol; SPICEPREFIX: C
D1 D2 = wouter:MBR0520L: ON Semi MBR0520L SMT Schottky Diode, 20V 500mA, 2-Pin SOD-123 Source: Datasheet <https://www.onsemi.com/pub/Collateral/MBR0520L-D.pdf>; DESCRIPTION: ON Semi MBR0520L SMT Schottky Diode, 20V 500mA, 2-Pin SOD-123; HEIGHT: 1.28mm; MANUFACTURER_NAME: ON Semiconductor; MANUFACTURER_PART_NUMBER: MBR0520L; MOUSER_PART_NUMBER: 512-MBR0520L; MOUSER_PRICE-STOCK: https://www.mouser.com/Search/Refine.aspx?Keyword=512-MBR0520L; RS_PART_NUMBER: 7390521P; RS_PRICE-STOCK: http://uk.rs-online.com/web/p/products/7390521P
IC1 = wouter:LT6238HGN#PBF: Rail-to-Rail Output 215MHz, 1.1nV/Hz Op Amp/SAR ADC Driver Source: Datasheet <http://www.analog.com/media/en/technical-documentation/data-sheets/623637fb.pdf>; DESCRIPTION: Rail-to-Rail Output 215MHz, 1.1nV/Hz Op Amp/SAR ADC Driver; HEIGHT: 1.75mm; MANUFACTURER_NAME: Linear Technology; MANUFACTURER_PART_NUMBER: LT6238HGN#PBF
R1-R4 = rcl:R-EU_: RESISTOR, European symbol; SPICEPREFIX: R

## Module ADC
Ports: ADIN0_P(in) ADIN1_N(in) ADIN2_P(in) ADIN2_N(in) ADIN3_P(in) ADIN3_N(in) ADIN4_P(in) ADIN4_N(in) CNV(in) BUSY(out) !CS(in) SCKI(in) SDI(in) SDO0(out) SDO1(out) SDO2(out) SDO3(out)
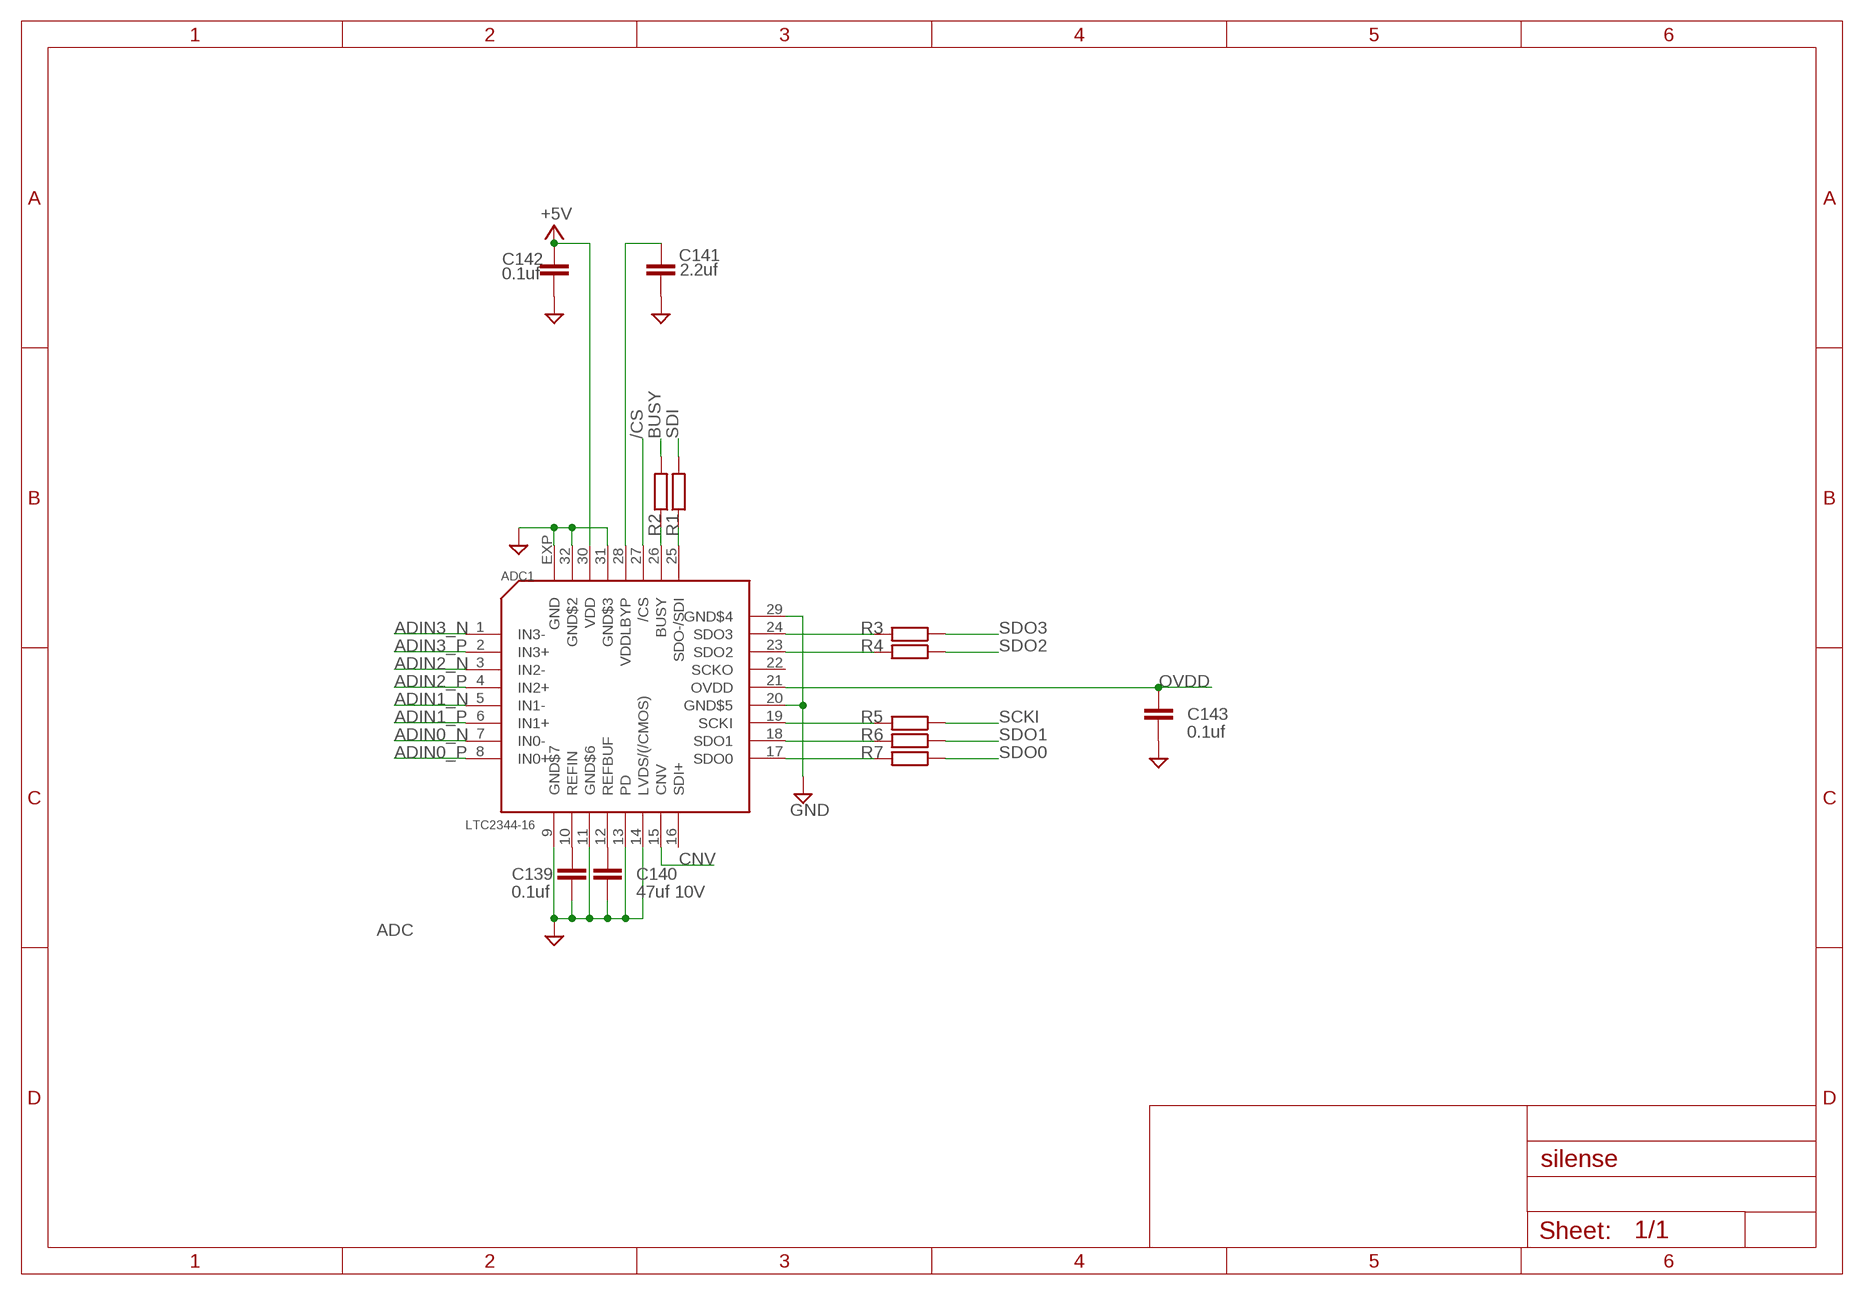
[diagram p4: schematic, module ADC, sheet 1]

### Parts
ADC1  LTC2344-16  [QFN32]
C139  0.1uf  C-EUC0402  [C0402]
C140  47uf 10V  C-EUC1210  [C1210]
C141  2.2uf  C-EUC0402  [C0402]
C142  0.1uf  C-EUC0402  [C0402]
C143  0.1uf  C-EUC0402  [C0402]
R1  33R  R-EU_R0402  [R0402]
R2  33R  R-EU_R0402  [R0402]
R3  33R  R-EU_R0402  [R0402]
R4  33R  R-EU_R0402  [R0402]
R5  33R  R-EU_R0402  [R0402]
R6  33R  R-EU_R0402  [R0402]
R7  33R  R-EU_R0402  [R0402]

### Nets
+5V: ADC1.30(VDD) C142.1
/CS: ADC1.27(/CS)
ADIN0_N: ADC1.7(IN0-)
ADIN0_P: ADC1.8(IN0+)
ADIN1_N: ADC1.5(IN1-)
ADIN1_P: ADC1.6(IN1+)
ADIN2_N: ADC1.3(IN2-)
ADIN2_P: ADC1.4(IN2+)
ADIN3_N: ADC1.1(IN3-)
ADIN3_P: ADC1.2(IN3+)
BUSY: R2.2
CNV: ADC1.15(CNV)
GND [power]: ADC1.9(GND$7) ADC1.11(GND$6) ADC1.13(PD) ADC1.14(LVDS/(/CMOS)) ADC1.20(GND$5) ADC1.29(GND$4) ADC1.31(GND$3) ADC1.32(GND$2) ADC1.EXP(GND) C139.2 C140.2 C141.2 C142.2 C143.2
N1: ADC1.26(BUSY) R2.1
N2: ADC1.25(SDO-/SDI) R1.1
N$1: ADC1.24(SDO3) R3.2
N$2: ADC1.23(SDO2) R4.2
N$3: ADC1.19(SCKI) R5.2
N$4: ADC1.18(SDO1) R6.2
N$5: ADC1.17(SDO0) R7.2
N$81: ADC1.10(REFIN) C139.1
N$82: ADC1.12(REFBUF) C140.1
N$83: ADC1.28(VDDLBYP) C141.1
OVDD: ADC1.21(OVDD) C143.1
SCKI: R5.1
SDI: R1.2
SDO0: R7.1
SDO1: R6.1
SDO2: R4.1
SDO3: R3.1
Unconnected: ADC1.16(SDI+) ADC1.22(SCKO)

### Notes on the sheet
- ADC

### Library data of the parts
ADC1 = wouter:LTC2344-16
C139-C143 = rcl:C-EU: CAPACITOR, European symbol; SPICEPREFIX: C
R1-R7 = rcl:R-EU_: RESISTOR, European symbol; SPICEPREFIX: R

## Module POWER
Ports: 
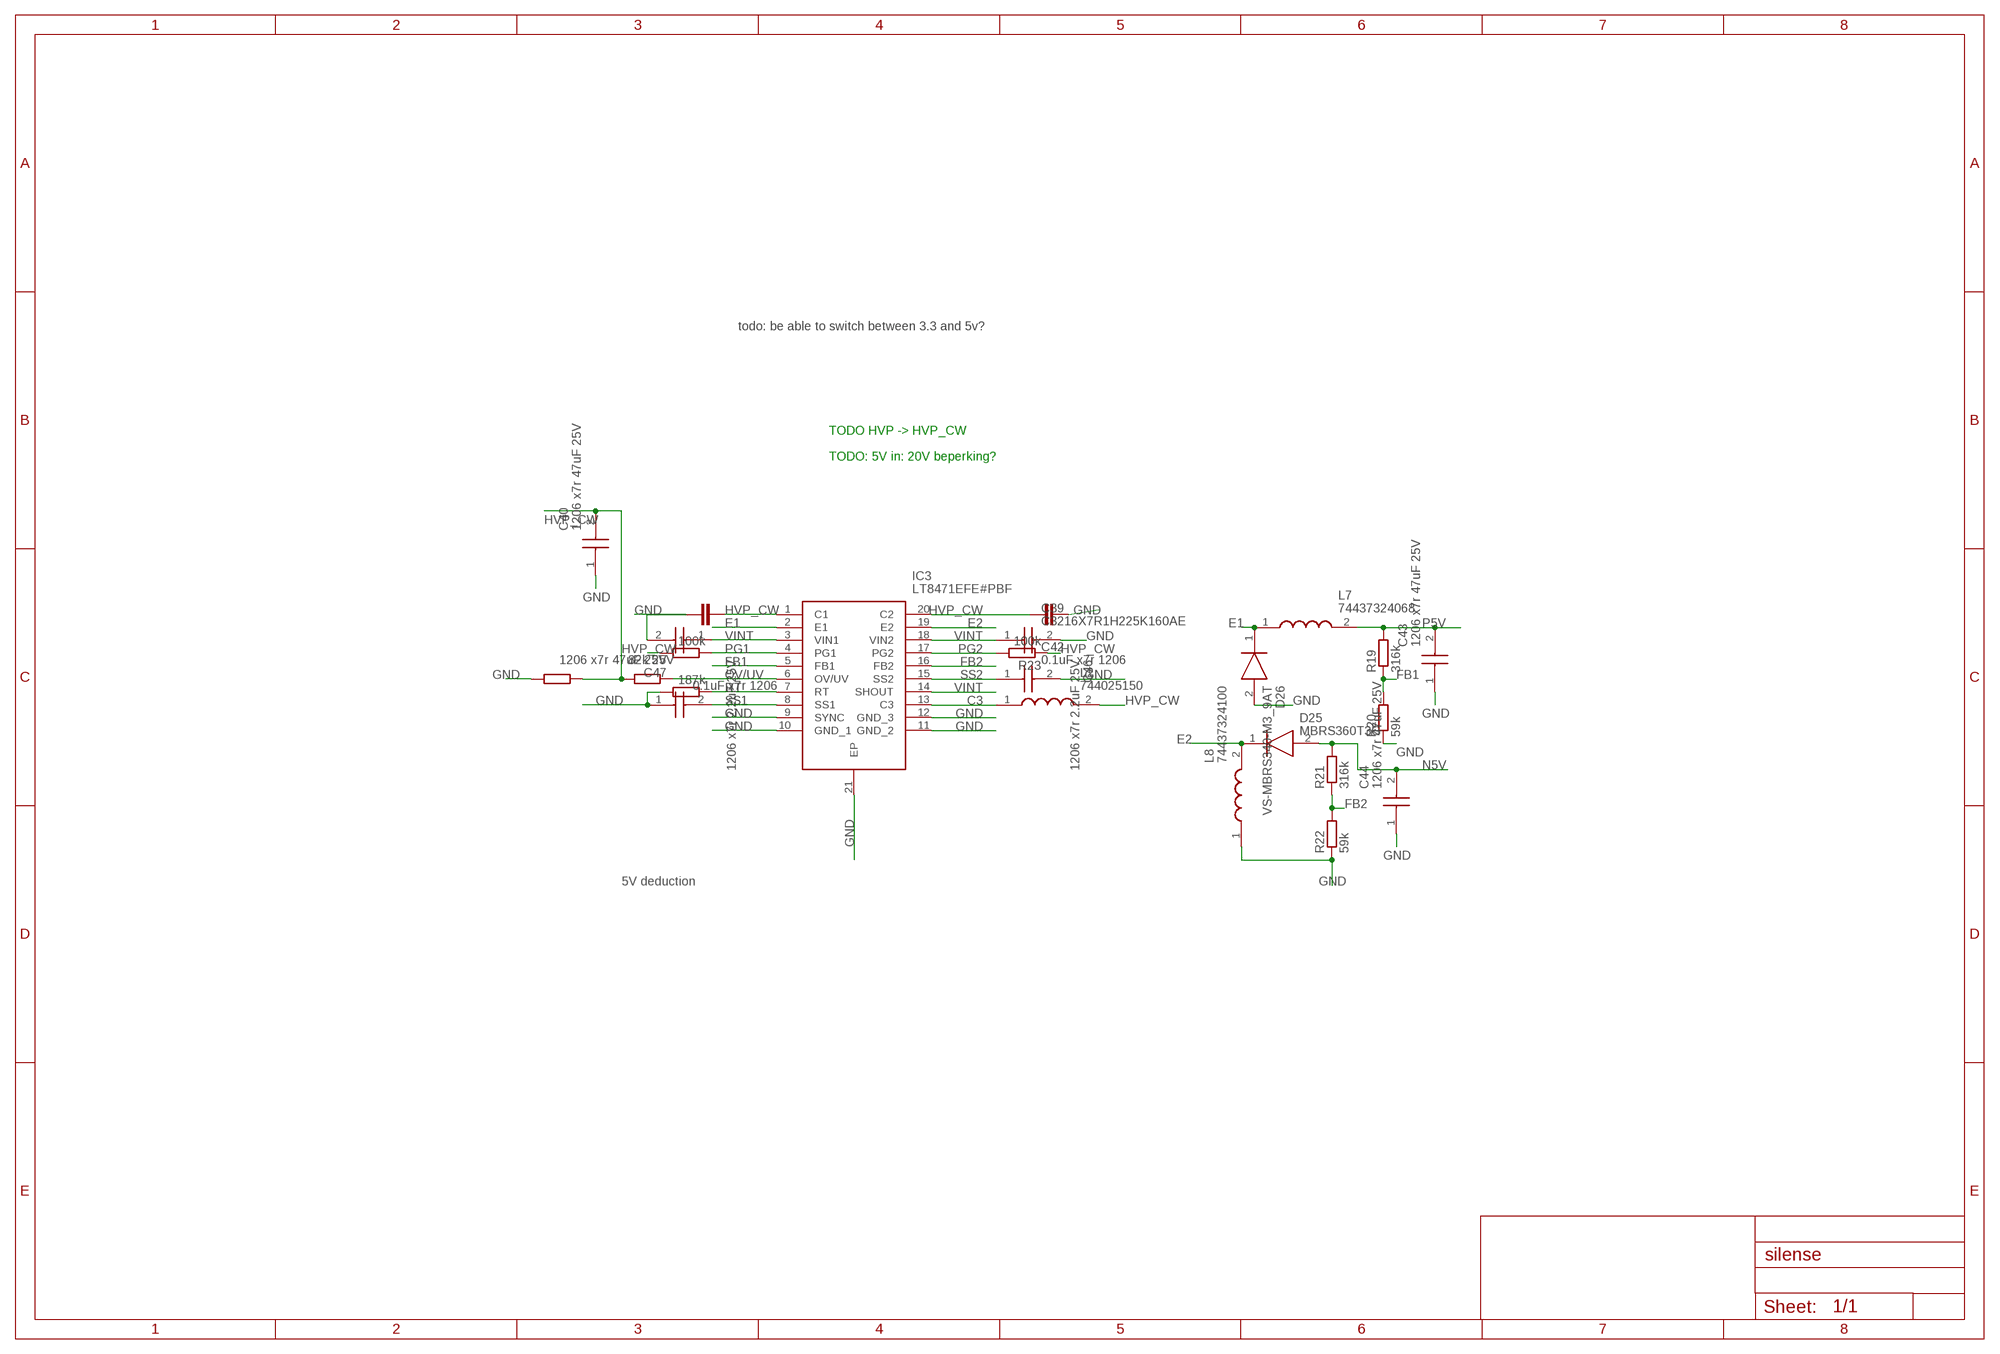
[diagram p5: schematic, module POWER, sheet 1]

### Parts
C39  C3216X7R1H225K160AE  [CAPC3216X180N]
C40  1206 x7r 47uF 25V  CKG57NX5R1E476M500JH  [CAPC6050X550N]
C41  0.1uF x7r 1206  MCSH31B104K500CT  [CAPC3416X90N]
C42  0.1uF x7r 1206  MCSH31B104K500CT  [CAPC3416X90N]
C43  1206 x7r 47uF 25V  CKG57NX5R1E476M500JH  [CAPC6050X550N]
C44  1206 x7r 47uF 25V  CKG57NX5R1E476M500JH  [CAPC6050X550N]
C45  1206 x7r 2.2uF 25V  C-EUC1206  [C1206]
C46  1206 x7r 2.2uF 25V  C-EUC1206  [C1206]
C47  1206 x7r 47uF 25V  CKG57NX5R1E476M500JH  [CAPC6050X550N]
D25  MBRS360T3G  [DIOM7958X256N]
D26  VS-MBRS340-M3_9AT  [DIOM7959X262N]
IC3  LT8471EFE#PBF  [SOP65P640X120-21N]
L2  744025150  [WE-TPC_282892]
L7  74437324068  [WE-LHMI_402048]
L8  74437324100  [WE-LHMI_402048]
R17  261k 25V  R-EU_M1206  [M1206]
R18  82k 25V  R-EU_M1206  [M1206]
R19  316k  R-EU_R1206  [R1206]
R20  59k  R-EU_R1206  [R1206]
R21  316k  R-EU_R1206  [R1206]
R22  59k  R-EU_R1206  [R1206]
R23  100k  R-EU_R1206  [R1206]
R24  100k  R-EU_R1206  [R1206]
R25  187k  R-EU_R1206  [R1206]

### Nets
C3: IC3.13(C3) L2.1
E1: D26.1(K) IC3.2(E1) L7.1
E2: D25.1(K) IC3.19(E2) L8.2
FB1: IC3.5(FB1) R19.1 R20.2
FB2: IC3.16(FB2) R21.1 R22.2
GND [power]: C39.2 C40.1 C41.1 C42.2 C43.1 C44.1 C45.2 C46.1 C47.2 D26.2(A) IC3.9(SYNC) IC3.10(GND_1) IC3.11(GND_2) IC3.12(GND_3) IC3.21(EP) L8.1 R18.1 R20.1 R22.1 R25.2
HVP_CW: C40.2 C45.1 C46.2 IC3.1(C1) IC3.20(C2) L2.2 R17.1 R18.2 R23.1 R24.2
N5V [power]: C44.2 D25.2(A) R21.2
OV/UV: IC3.6(OV/UV) R17.2
P5V [power]: C43.2 L7.2 R19.2
PG1: IC3.4(PG1) R24.1
PG2: IC3.17(PG2) R23.2
RT: IC3.7(RT) R25.1
SS1: C41.2 IC3.8(SS1)
SS2: C42.1 IC3.15(SS2)
VINT: C39.1 C47.1 IC3.3(VIN1) IC3.14(SHOUT) IC3.18(VIN2)

### Notes on the sheet
- todo: be able to switch between 3.3 and 5v?
- TODO HVP -> HVP_CW
- TODO: 5V in: 20V beperking?
- 5V deduction

### Library data of the parts
C39 = samacsys:C3216X7R1H225K160AE: Multilayer Ceramic Capacitors MLCC - SMD/SMT 3216 2.2uF 50volts X7R 10% Soft Term Source: Datasheet <https://product.tdk.com/info/en/catalog/datasheets/mlcc_commercial_midvoltage_en.pdf>; DESCRIPTION: Multilayer Ceramic Capacitors MLCC - SMD/SMT 3216 2.2uF 50volts X7R 10% Soft Term; HEIGHT: 1.8mm; MANUFACTURER_NAME: TDK; MANUFACTURER_PART_NUMBER: C3216X7R1H225K160AE; MOUSER_PART_NUMBER: 810-C3216X7R1H225KST; MOUSER_PRICE-STOCK: http://www.mouser.com/Search/ProductDetail.aspx?qs=LcTL%2f5vFEzF%2fV37W3zk7cA%3d%3d
C40 C43 C44 C47 = samacsys:CKG57NX5R1E476M500JH: CKG SMT 2-chip capacitor,X5R,25V,47uF TDK 47F Multilayer Ceramic Capacitor (MLCC) 25 V dc 20% X5R dielectric CKG max op. temp. +85C Source: Datasheet <https://docs-emea.rs-online.com/webdocs/1533/0900766b815331ac.pdf>; DESCRIPTION: CKG SMT 2-chip capacitor,X5R,25V,47uF TDK 47F Multilayer Ceramic Capacitor (MLCC) 25 V dc 20% X5R dielectric CKG max op. temp. +85C; HEIGHT: 5.5mm; MANUFACTURER_NAME: TDK; MANUFACTURER_PART_NUMBER: CKG57NX5R1E476M500JH; MOUSER_PART_NUMBER: 5477168P; MOUSER_PRICE-STOCK: http://uk.rs-online.com/web/p/products/5477168P; RS_PART_NUMBER: 5477168P; RS_PRICE-STOCK: http://uk.rs-online.com/web/p/products/5477168P
C41 C42 = samacsys:MCSH31B104K500CT: MULTICOMP - MCSH31B104K500CT - CAP, MLCC, X7R, 100NF, 50V, 1206 Source: Datasheet <http://www.farnell.com/datasheets/1825494.pdf>; DESCRIPTION: MULTICOMP - MCSH31B104K500CT - CAP, MLCC, X7R, 100NF, 50V, 1206; HEIGHT: 0.9mm; MANUFACTURER_NAME: MULTICOMP; MANUFACTURER_PART_NUMBER: MCSH31B104K500CT
C45 C46 = rcl:C-EU: CAPACITOR, European symbol; SPICEPREFIX: C
D25 = samacsys:MBRS360T3G: Schottky barrier diode,MBRS360T3 3A 60V ON Semiconductor MBRS360T3G Schottky Diode, 4A, 60V, 2-Pin SMC Source: Datasheet <http://www.onsemi.com/pub/Collateral/MBRS360T3-D.PDF>; ALLIED_NUMBER: 70099510; ALLIED_PRICE-STOCK: http://www.alliedelec.com/on-semiconductor-mbrs360t3g/70099510/; DESCRIPTION: Schottky barrier diode,MBRS360T3 3A 60V ON Semiconductor MBRS360T3G Schottky Diode, 4A, 60V, 2-Pin SMC; HEIGHT: 2.56mm; MANUFACTURER_NAME: ON Semiconductor; MANUFACTURER_PART_NUMBER: MBRS360T3G; MOUSER_PART_NUMBER: 863-MBRS360T3G; MOUSER_PRICE-STOCK: https://www.mouser.com/Search/Refine.aspx?Keyword=863-MBRS360T3G; RS_PART_NUMBER: 5452096P; RS_PRICE-STOCK: http://uk.rs-online.com/web/p/products/5452096P
D26 = samacsys:VS-MBRS340-M3_9AT: Schottky Diodes & Rectifiers 3A 40V Single Die Schottky Rectifier Source: Datasheet <https://componentsearchengine.com/Datasheets/1/VS-MBRS340-M3_9AT.pdf>; DESCRIPTION: Schottky Diodes & Rectifiers 3A 40V Single Die Schottky Rectifier; HEIGHT: 2.62mm; MANUFACTURER_NAME: Vishay; MANUFACTURER_PART_NUMBER: VS-MBRS340-M3/9AT; MOUSER_PART_NUMBER: 78-VS-MBRS340-M39AT; MOUSER_PRICE-STOCK: https://www.mouser.com/Search/Refine.aspx?Keyword=78-VS-MBRS340-M39AT; RS_PART_NUMBER: 0301990P; RS_PRICE-STOCK: http://uk.rs-online.com/web/p/products/0301990P
IC3 = samacsys:LT8471EFE#PBF: Linear Technology LT8471EFE#PBF, Dual, DC-DC DC-DC Converter, Adjustable, 1.35A 20-Pin, TSSOP Source: Datasheet <https://www.analog.com/media/en/technical-documentation/data-sheets/8471fd.pdf>; DESCRIPTION: Linear Technology LT8471EFE#PBF, Dual, DC-DC DC-DC Converter, Adjustable, 1.35A 20-Pin, TSSOP; HEIGHT: 1.2mm; MANUFACTURER_NAME: Linear Technology; MANUFACTURER_PART_NUMBER: LT8471EFE#PBF; MOUSER_PART_NUMBER: 584-LT8471EFE#PBF; MOUSER_PRICE-STOCK: https://www.mouser.com/Search/Refine.aspx?Keyword=584-LT8471EFE%23PBF; RS_PART_NUMBER: 1513320; RS_PRICE-STOCK: http://uk.rs-online.com/web/p/products/1513320
L2 = samacsys:744025150: Wurth WE-TPC Series Shielded Wire-wound SMD Inductor with a Ferrite Core, 15 H 20% 900mA Idc Source: Datasheet; DESCRIPTION: Wurth WE-TPC Series Shielded Wire-wound SMD Inductor with a Ferrite Core, 15 H 20% 900mA Idc; HEIGHT: mm; MANUFACTURER_NAME: Wurth Elektronik; MANUFACTURER_PART_NUMBER: 744025150; MOUSER_PART_NUMBER: 710-744025150; MOUSER_PRICE-STOCK: https://www.mouser.com/Search/Refine.aspx?Keyword=710-744025150; RS_PART_NUMBER: 7373639P; RS_PRICE-STOCK: http://uk.rs-online.com/web/p/products/7373639P
L7 = samacsys:74437324068: SMD Power Inductor WE-LHMI Source: Datasheet <http://componentsearchengine.com/Datasheets/1/74437324068.pdf>; DESCRIPTION: SMD Power Inductor WE-LHMI; HEIGHT: mm; MANUFACTURER_NAME: Wurth Elektronik; MANUFACTURER_PART_NUMBER: 74437324068; MOUSER_PART_NUMBER: 710-74437324068; MOUSER_PRICE-STOCK: https://www.mouser.com/Search/Refine.aspx?Keyword=710-74437324068; RS_PART_NUMBER: 7568480P; RS_PRICE-STOCK: http://uk.rs-online.com/web/p/products/7568480P
L8 = samacsys:74437324100: SMD Power Inductor WE-LHMI Source: Datasheet <http://componentsearchengine.com/Datasheets/1/74437324100.pdf>; DESCRIPTION: SMD Power Inductor WE-LHMI; HEIGHT: mm; MANUFACTURER_NAME: Wurth Elektronik; MANUFACTURER_PART_NUMBER: 74437324100; MOUSER_PART_NUMBER: 710-74437324100; MOUSER_PRICE-STOCK: https://www.mouser.com/Search/Refine.aspx?Keyword=710-74437324100; RS_PART_NUMBER: 7568487P; RS_PRICE-STOCK: http://uk.rs-online.com/web/p/products/7568487P
R17 R18 = resistor:R-EU_: RESISTOR, European symbol
R19-R25 = rcl:R-EU_: RESISTOR, European symbol; SPICEPREFIX: R

## Module CONN_FPGA
Ports: CNV0(out) BUSY0(in) CS0(out) ADC_CLK_0(out) SDI0(out) SDO0_0(in) SDO0_1(in) SDO0_2(in) SDO0_3(in) CNV1(out) BUSY1(in) CS1(out) ADC_CLK_1(out) SDI1(out) SDO1_0(in) SDO1_1(in) SDO1_2(in) SDO1_3(in) CNV2(out) BUSY2(in) CS2(out) ADC_CLK_2(out) SDI2(out) SDO2_0(in) SDO2_1(in) SDO2_2(in) SDO2_3(in) CNV3(out) BUSY3(in) CS3(out) SDI3(out) SDO3_0(in) SDO3_1(in) SDO3_2(in) SDO3_3(in) ADC_CLK_3(out) IN0_0(out) IN0_1(out) IN1_0(out) IN1_1(out) IN2_0(out) IN2_1(out) IN3_0(out) IN3_1(out) IN4_0(out) IN4_1(out) IN5_0(out) IN5_1(out) IN6_0(out) IN6_1(out) IN7_0(out) IN7_1(out) IN8_0(out) IN8_1(out) IN9_0(out) IN9_1(out) IN10_0(out) IN10_1(out) IN11_0(out) IN11_1(out) IN12_0(out) IN12_1(out) IN13_0(out) IN13_1(out) IN14_0(out) IN14_1(out) IN15_0(out) IN15_1(out) CW(io)
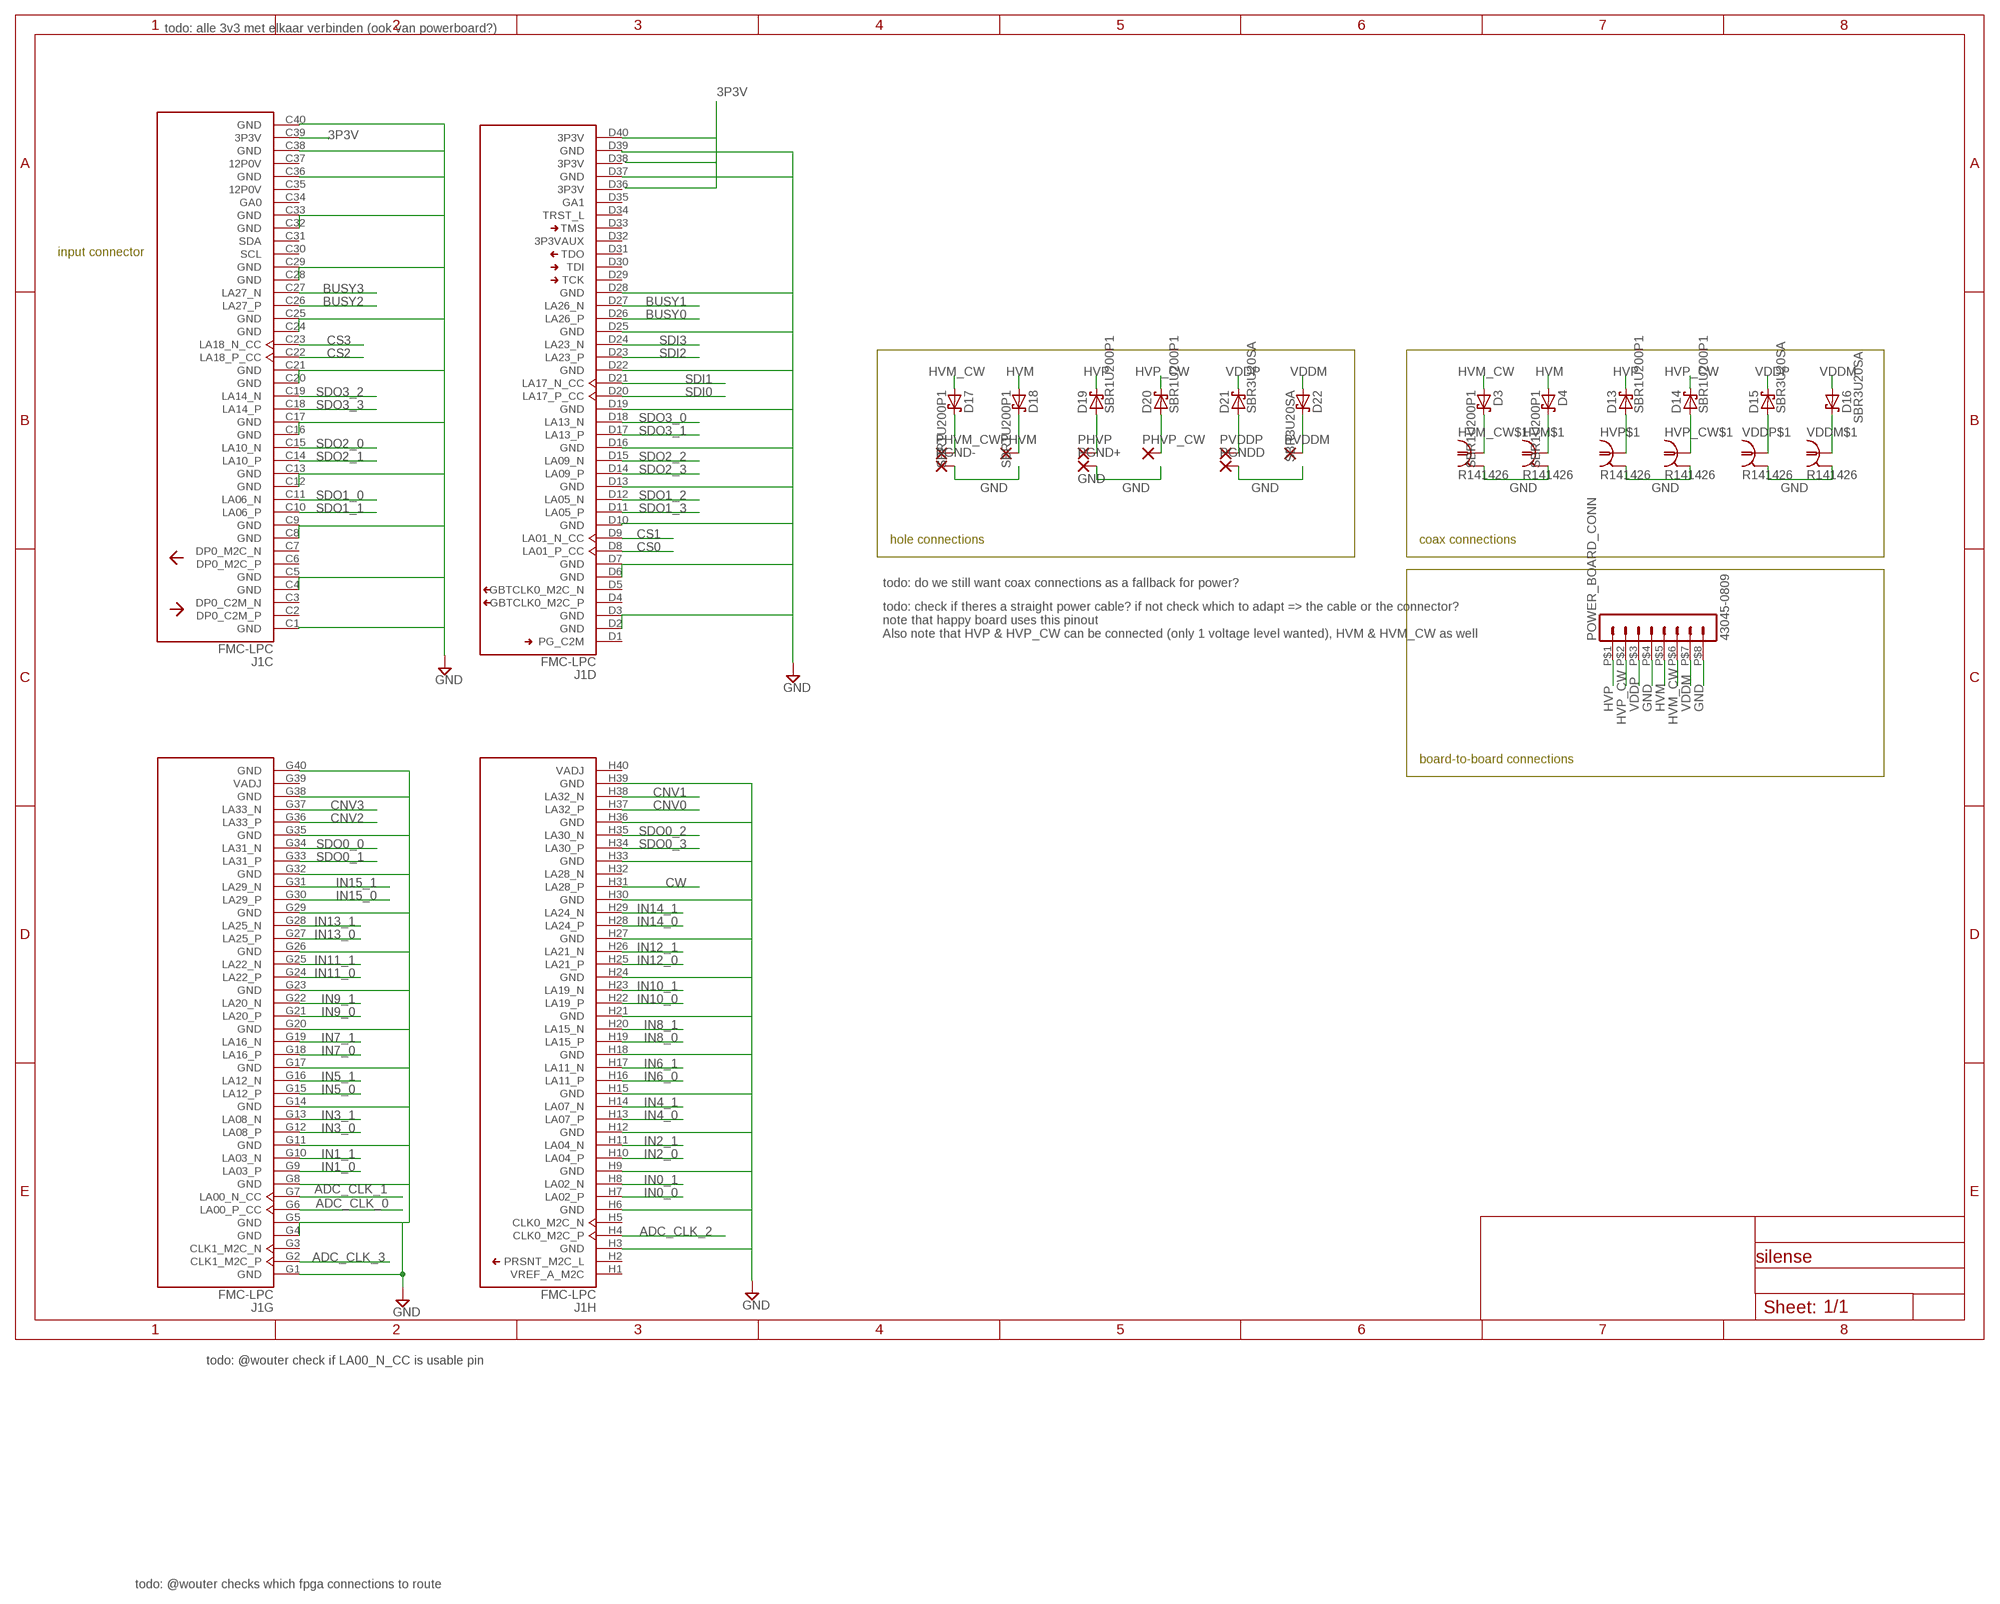
[diagram p6: schematic, module CONN_FPGA, sheet 1]

### Parts
D3  SBR1U200P1  SBR1U200P1SBR1U200P1  [POWERDI-123]
D4  SBR1U200P1  SBR1U200P1SBR1U200P1  [POWERDI-123]
D13  SBR1U200P1  SBR1U200P1SBR1U200P1  [POWERDI-123]
D14  SBR1U200P1  SBR1U200P1SBR1U200P1  [POWERDI-123]
D15  SBR3U20SA  SBR3U20SASBR3U20SA  [POWERDI-123]
D16  SBR3U20SA  SBR3U20SASBR3U20SA  [POWERDI-123]
D17  SBR1U200P1  SBR1U200P1SBR1U200P1  [POWERDI-123]
D18  SBR1U200P1  SBR1U200P1SBR1U200P1  [POWERDI-123]
D19  SBR1U200P1  SBR1U200P1SBR1U200P1  [POWERDI-123]
D20  SBR1U200P1  SBR1U200P1SBR1U200P1  [POWERDI-123]
D21  SBR3U20SA  SBR3U20SASBR3U20SA  [POWERDI-123]
D22  SBR3U20SA  SBR3U20SASBR3U20SA  [POWERDI-123]
HVM$1  R141426  [R141426]
HVM_CW$1  R141426  [R141426]
HVP$1  R141426  [R141426]
HVP_CW$1  R141426  [R141426]
J1  FMC-LPC  [FMC-LPC-MALE]
PGND+  GND  3,17/1,3  [3,17/1,3]
PGND-  3,17/1,3  [3,17/1,3]
PGNDD  3,17/1,3  [3,17/1,3]
PHVM  3,17/1,3  [3,17/1,3]
PHVM_CW  3,17/1,3  [3,17/1,3]
PHVP  3,17/1,3  [3,17/1,3]
PHVP_CW  3,17/1,3  [3,17/1,3]
POWER_BOARD_CONN  43045-0809  HEADER_POS8_43045-0809  [43045-0809]
PVDDM  3,17/1,3  [3,17/1,3]
PVDDP  3,17/1,3  [3,17/1,3]
VDDM$1  R141426  [R141426]
VDDP$1  R141426  [R141426]

### Nets
3P3V: J1.C39(C:3P3V) J1.D40(D:3P3V)
ADC_CLK_0: J1.G6(G:LA00_P_CC)
ADC_CLK_1: J1.G7(G:LA00_N_CC)
ADC_CLK_2: J1.H4(H:CLK0_M2C_P)
ADC_CLK_3: J1.G2(G:CLK1_M2C_P)
BUSY0: J1.D26(D:LA26_P)
BUSY1: J1.D27(D:LA26_N)
BUSY2: J1.C26(C:LA27_P)
BUSY3: J1.C27(C:LA27_N)
CNV0: J1.H37(H:LA32_P)
CNV1: J1.H38(H:LA32_N)
CNV2: J1.G36(G:LA33_P)
CNV3: J1.G37(G:LA33_N)
CS0: J1.D8(D:LA01_P_CC)
CS1: J1.D9(D:LA01_N_CC)
CS2: J1.C22(C:LA18_P_CC)
CS3: J1.C23(C:LA18_N_CC)
CW: J1.H31(H:LA28_P)
GND [power]: HVM$1.2 HVM$1.3 HVM$1.4 HVM$1.5 HVM_CW$1.2 HVM_CW$1.3 HVM_CW$1.4 HVM_CW$1.5 HVP$1.2 HVP$1.3 HVP$1.4 HVP$1.5 HVP_CW$1.2 HVP_CW$1.3 HVP_CW$1.4 HVP_CW$1.5 J1.C1(C:GND) J1.C4(C:GND) J1.C5(C:GND) J1.C8(C:GND) J1.C9(C:GND) J1.C12(C:GND) J1.C13(C:GND) J1.C16(C:GND) J1.C17(C:GND) J1.C20(C:GND) J1.C21(C:GND) J1.C24(C:GND) J1.C25(C:GND) J1.C28(C:GND) J1.C29(C:GND) J1.C32(C:GND) J1.C33(C:GND) J1.C36(C:GND) J1.C38(C:GND) J1.C40(C:GND) J1.D2(D:GND) J1.D3(D:GND) J1.D6(D:GND) J1.D7(D:GND) J1.D10(D:GND) J1.D13(D:GND) J1.D16(D:GND) J1.D19(D:GND) J1.D22(D:GND) J1.D25(D:GND) J1.D28(D:GND) J1.D37(D:GND) J1.D39(D:GND) J1.G1(G:GND) J1.H3(H:GND) J1.H6(H:GND) J1.H9(H:GND) J1.H12(H:GND) J1.H15(H:GND) J1.H18(H:GND) J1.H21(H:GND) J1.H24(H:GND) J1.H27(H:GND) J1.H30(H:GND) J1.H33(H:GND) J1.H36(H:GND) J1.H39(H:GND) PGND+.1(P) PGND-.1(P) PGNDD.1(P) POWER_BOARD_CONN.P$4 POWER_BOARD_CONN.P$8 VDDM$1.2 VDDM$1.3 VDDM$1.4 VDDM$1.5 VDDP$1.2 VDDP$1.3 VDDP$1.4 VDDP$1.5
HVM: D4.A D18.A POWER_BOARD_CONN.P$5
HVM_CW: D3.A D17.A POWER_BOARD_CONN.P$6
HVP [power]: D13.C D19.C POWER_BOARD_CONN.P$1
HVP_CW: D14.C D20.C POWER_BOARD_CONN.P$2
IN0_0: J1.H7(H:LA02_P)
IN0_1: J1.H8(H:LA02_N)
IN1_0: J1.G9(G:LA03_P)
IN1_1: J1.G10(G:LA03_N)
IN2_0: J1.H10(H:LA04_P)
IN2_1: J1.H11(H:LA04_N)
IN3_0: J1.G12(G:LA08_P)
IN3_1: J1.G13(G:LA08_N)
IN4_0: J1.H13(H:LA07_P)
IN4_1: J1.H14(H:LA07_N)
IN5_0: J1.G15(G:LA12_P)
IN5_1: J1.G16(G:LA12_N)
IN6_0: J1.H16(H:LA11_P)
IN6_1: J1.H17(H:LA11_N)
IN7_0: J1.G18(G:LA16_P)
IN7_1: J1.G19(G:LA16_N)
IN8_0: J1.H19(H:LA15_P)
IN8_1: J1.H20(H:LA15_N)
IN9_0: J1.G21(G:LA20_P)
IN9_1: J1.G22(G:LA20_N)
IN10_0: J1.H22(H:LA19_P)
IN10_1: J1.H23(H:LA19_N)
IN11_0: J1.G24(G:LA22_P)
IN11_1: J1.G25(G:LA22_N)
IN12_0: J1.H25(H:LA21_P)
IN12_1: J1.H26(H:LA21_N)
IN13_0: J1.G27(G:LA25_P)
IN13_1: J1.G28(G:LA25_N)
IN14_0: J1.H28(H:LA24_P)
IN14_1: J1.H29(H:LA24_N)
IN15_0: J1.G30(G:LA29_P)
IN15_1: J1.G31(G:LA29_N)
N$1 [power]: J1.G4(G:GND) J1.G5(G:GND) J1.G8(G:GND) J1.G11(G:GND) J1.G14(G:GND) J1.G17(G:GND) J1.G20(G:GND) J1.G23(G:GND) J1.G26(G:GND) J1.G29(G:GND) J1.G32(G:GND) J1.G35(G:GND) J1.G38(G:GND) J1.G40(G:GND)
N$3: D17.C PHVM_CW.1(P)
N$4: D18.C PHVM.1(P)
N$17: D3.C HVM_CW$1.1
N$18: D4.C HVM$1.1
N$19: D13.A HVP$1.1
N$20: D14.A HVP_CW$1.1
N$21: D15.A VDDP$1.1
N$22: D16.C VDDM$1.1
N$25: D19.A PHVP.1(P)
N$26: D20.A PHVP_CW.1(P)
N$27: D21.A PVDDP.1(P)
N$28: D22.C PVDDM.1(P)
SDI0: J1.D20(D:LA17_P_CC)
SDI1: J1.D21(D:LA17_N_CC)
SDI2: J1.D23(D:LA23_P)
SDI3: J1.D24(D:LA23_N)
SDO0_0: J1.G34(G:LA31_N)
SDO0_1: J1.G33(G:LA31_P)
SDO0_2: J1.H35(H:LA30_N)
SDO0_3: J1.H34(H:LA30_P)
SDO1_0: J1.C11(C:LA06_N)
SDO1_1: J1.C10(C:LA06_P)
SDO1_2: J1.D12(D:LA05_N)
SDO1_3: J1.D11(D:LA05_P)
SDO2_0: J1.C15(C:LA10_N)
SDO2_1: J1.C14(C:LA10_P)
SDO2_2: J1.D15(D:LA09_N)
SDO2_3: J1.D14(D:LA09_P)
SDO3_0: J1.D18(D:LA13_N)
SDO3_1: J1.D17(D:LA13_P)
SDO3_2: J1.C19(C:LA14_N)
SDO3_3: J1.C18(C:LA14_P)
VDDM: D16.A D22.A POWER_BOARD_CONN.P$7
VDDP: D15.C D21.C POWER_BOARD_CONN.P$3
Unconnected: J1.C2(C:DP0_C2M_P) J1.C3(C:DP0_C2M_N) J1.C6(C:DP0_M2C_P) J1.C7(C:DP0_M2C_N) J1.C30(C:SCL) J1.C31(C:SDA) J1.C34(C:GA0) J1.C35(C:12P0V) J1.C37(C:12P0V) J1.D1(D:PG_C2M) J1.D4(D:GBTCLK0_M2C_P) J1.D5(D:GBTCLK0_M2C_N) J1.D29(D:TCK) J1.D30(D:TDI) J1.D31(D:TDO) J1.D32(D:3P3VAUX) J1.D33(D:TMS) J1.D34(D:TRST_L) J1.D35(D:GA1) J1.D36(D:3P3V) J1.D38(D:3P3V) J1.G3(G:CLK1_M2C_N) J1.G39(G:VADJ) J1.H1(H:VREF_A_M2C) J1.H2(H:PRSNT_M2C_L) J1.H5(H:CLK0_M2C_N) J1.H32(H:LA28_N) J1.H40(H:VADJ)

### Notes on the sheet
- todo: alle 3v3 met elkaar verbinden (ook van powerboard?)
- input connector
- hole connections | coax connections
- todo: do we still want coax connections as a fallback for power?
- todo: check if theres a straight power cable? if not check which to adapt => the cable or the connector?
  note that happy board uses this pinout
  Also note that HVP & HVP_CW can be connected (only 1 voltage level wanted), HVM & HVM_CW as well
- board-to-board connections
- todo: @wouter check if LA00_N_CC is usable pin
- todo: @wouter checks which fpga connections to route

### Library data of the parts
D3 D4 D13 D14 D17-D20 = dfls130l-7:SBR1U200P1: Super Barrier Rectifier Diode; MF: Diodes Inc; MOUSER: SBR1U200P1-7; MPN: SBR1U200P1
D15 D16 D21 D22 = dfls130l-7:SBR3U20SA: Super Barrier Rectifier Diode; MF: Diodes Inc; MOUSER: SBR3U20SA; MPN: SBR3U20SA
HVM$1 HVM_CW$1 HVP$1 HVP_CW$1 VDDM$1 VDDP$1 = con-coax:R141426: BNC COAX CONNECTOR Radiall 50/75 Ohm Spoerle; MF: FARNELL; MPN: R141426161; OC_FARNELL: 4195115; OC_NEWARK: 14J7919
J1 = wouter:FMC-LPC: FMC-LPC Bottom side connector for interfacing with Xilinx FPGA development boards (e.g. SP605)
PGND+ PGND- PGNDD PHVM PHVM_CW PHVP PHVP_CW PVDDM PVDDP = wirepad:3,17/1,3: THROUGH-HOLE PAD
POWER_BOARD_CONN = con-molex-micro-fit-3_0:HEADER_POS8_?: Molex - Micro-Fit 3.0 Series connector, 3.00mm (0.118") pitch header, 8 positions.

## Module DRIVER
Ports: OUT_0(io) OUT_1(io) OUT_2(io) OUT_3(io) OUT_4(io) OUT_5(io) OUT_6(io) OUT_7(io) IN0_0(in) IN0_1(in) IN1_0(in) IN1_1(in) IN2_0(in) IN2_1(in) IN3_0(in) IN3_1(in) IN4_0(in) IN4_1(in) IN5_0(in) IN5_1(in) IN6_0(in) IN6_1(in) IN7_0(in) IN7_1(in) LVOUT_0(io) LVOUT_1(io) LVOUT_2(io) LVOUT_3(io) LVOUT_4(io) LVOUT_5(io) LVOUT_6(io) LVOUT_7(io) CW(io)
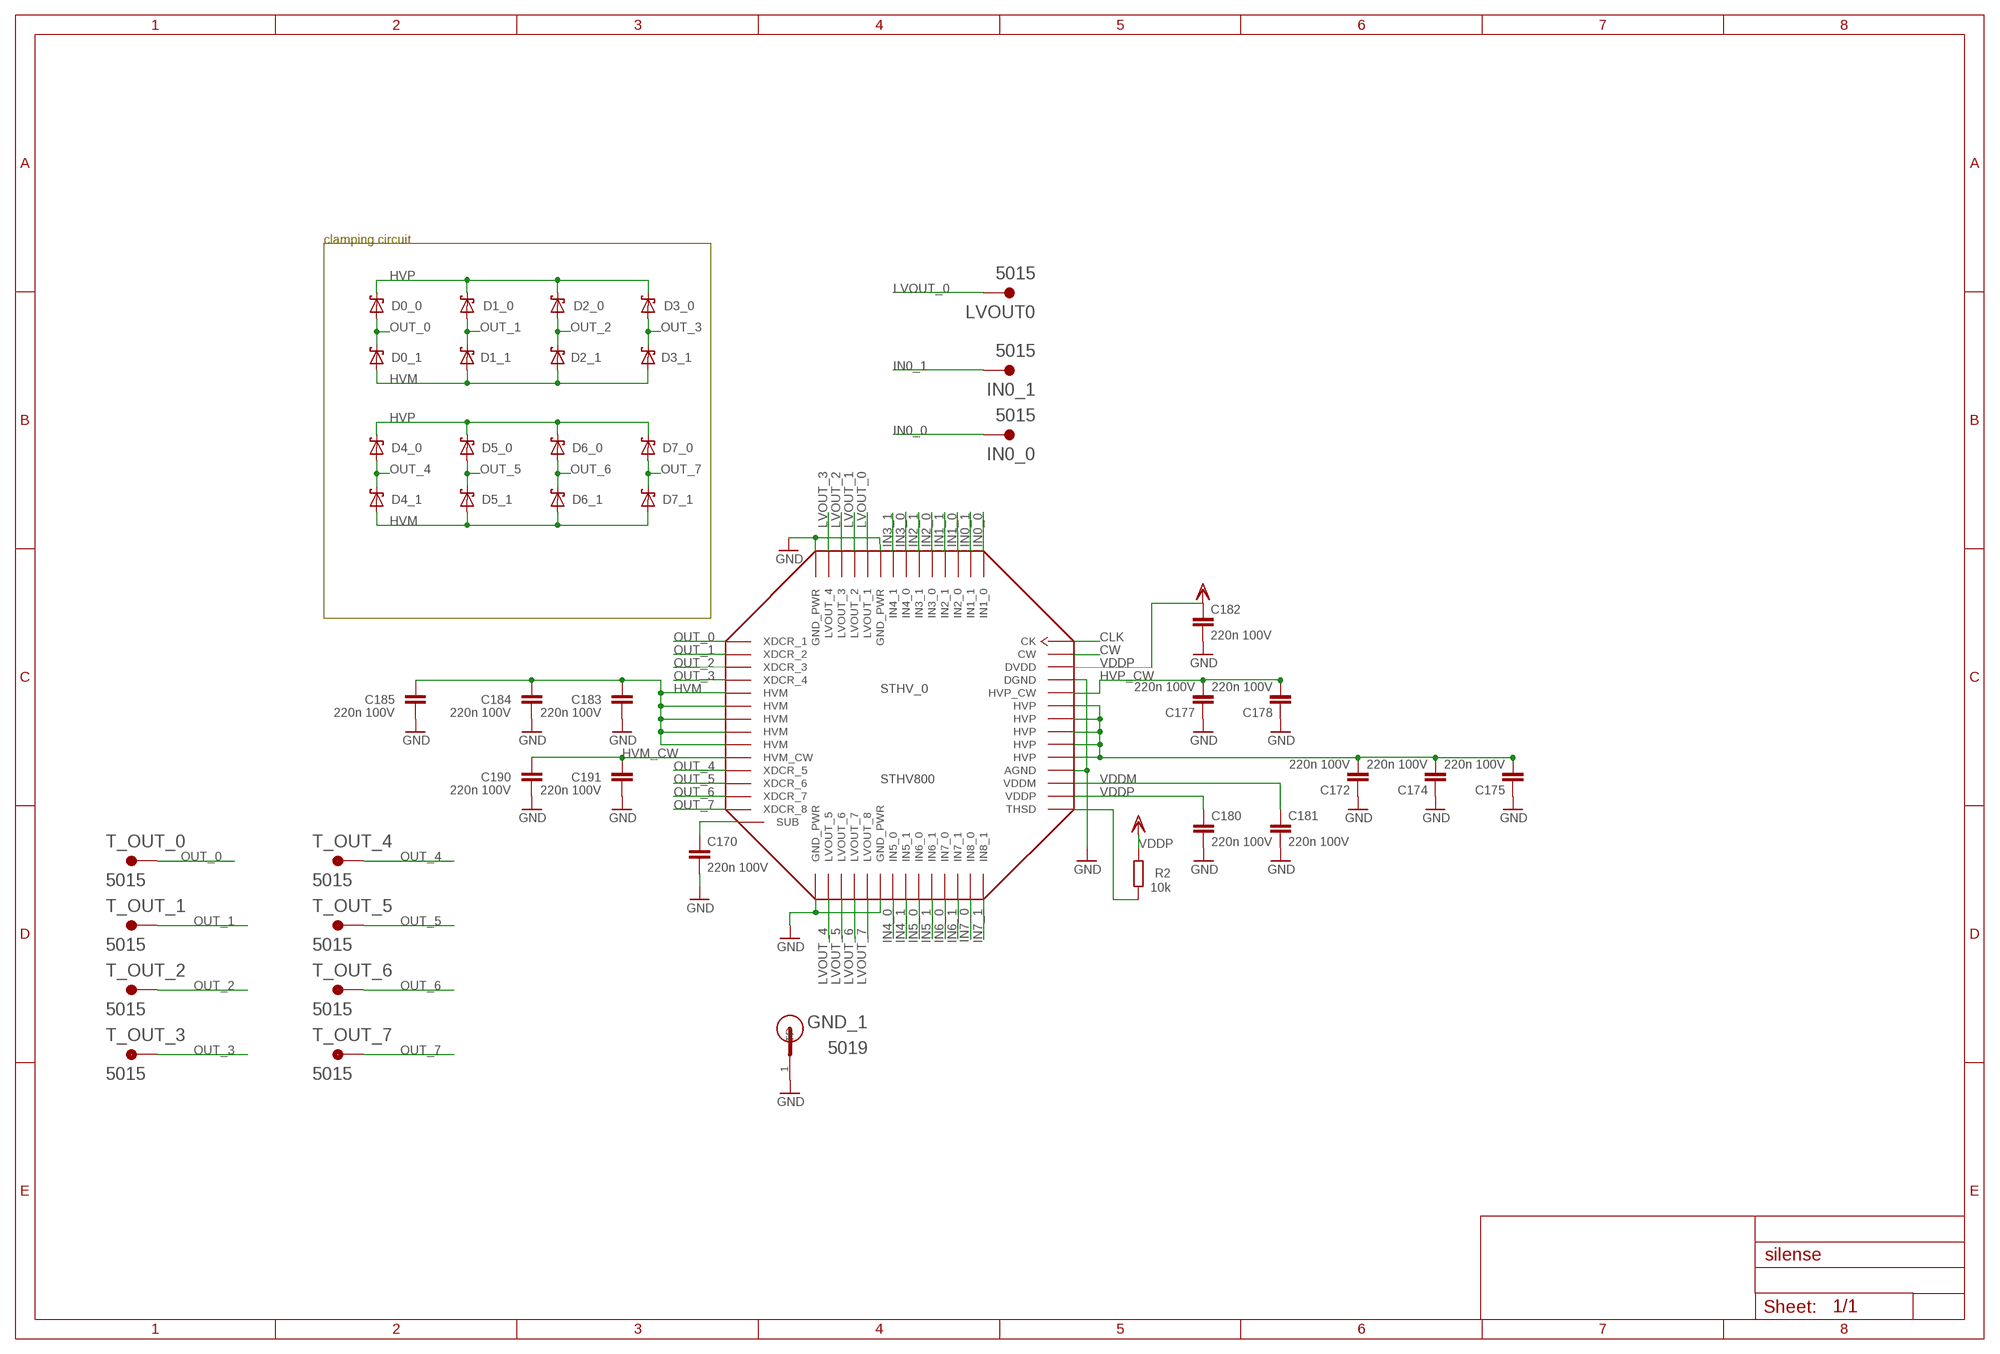
[diagram p7: schematic, module DRIVER, sheet 1]

### Parts
C170  220n 100V  C-EUC0805  [C0805]
C172  220n 100V  C-EUC0805  [C0805]
C174  220n 100V  C-EUC0805  [C0805]
C175  220n 100V  C-EUC0805  [C0805]
C177  220n 100V  C-EUC0805  [C0805]
C178  220n 100V  C-EUC0805  [C0805]
C180  220n 100V  C-EUC0805  [C0805]
C181  220n 100V  C-EUC0805  [C0805]
C182  220n 100V  C-EUC0805  [C0805]
C183  220n 100V  C-EUC0805  [C0805]
C184  220n 100V  C-EUC0805  [C0805]
C185  220n 100V  C-EUC0805  [C0805]
C190  220n 100V  C-EUC0805  [C0805]
C191  220n 100V  C-EUC0805  [C0805]
D0_0  SBR1U200P1SBR1U200P1  [POWERDI-123]
D0_1  SBR1U200P1SBR1U200P1  [POWERDI-123]
D1_0  SBR1U200P1SBR1U200P1  [POWERDI-123]
D1_1  SBR1U200P1SBR1U200P1  [POWERDI-123]
D2_0  SBR1U200P1SBR1U200P1  [POWERDI-123]
D2_1  SBR1U200P1SBR1U200P1  [POWERDI-123]
D3_0  SBR1U200P1SBR1U200P1  [POWERDI-123]
D3_1  SBR1U200P1SBR1U200P1  [POWERDI-123]
D4_0  SBR1U200P1SBR1U200P1  [POWERDI-123]
D4_1  SBR1U200P1SBR1U200P1  [POWERDI-123]
D5_0  SBR1U200P1SBR1U200P1  [POWERDI-123]
D5_1  SBR1U200P1SBR1U200P1  [POWERDI-123]
D6_0  SBR1U200P1SBR1U200P1  [POWERDI-123]
D6_1  SBR1U200P1SBR1U200P1  [POWERDI-123]
D7_0  SBR1U200P1SBR1U200P1  [POWERDI-123]
D7_1  SBR1U200P1SBR1U200P1  [POWERDI-123]
GND_1  5019  [TP380X203]
IN0_0  5015  [KEYSTONE_5015]
IN0_1  5015  [KEYSTONE_5015]
LVOUT0  5015  [KEYSTONE_5015]
R2  10k  R-EU_R0805  [R0805]
STHV_0  STHV800  [TFLGA-56LD]
T_OUT_0  5015  [KEYSTONE_5015]
T_OUT_1  5015  [KEYSTONE_5015]
T_OUT_2  5015  [KEYSTONE_5015]
T_OUT_3  5015  [KEYSTONE_5015]
T_OUT_4  5015  [KEYSTONE_5015]
T_OUT_5  5015  [KEYSTONE_5015]
T_OUT_6  5015  [KEYSTONE_5015]
T_OUT_7  5015  [KEYSTONE_5015]

### Nets
CLK: STHV_0.CK
CW: STHV_0.CW
GND [power_cw]: C170.2 C172.1 C174.1 C175.1 C177.1 C178.1 C180.2 C181.2 C182.2 C183.2 C184.2 C185.2 C190.1 C191.1 GND_1.1(TP) STHV_0.AGND STHV_0.DGND STHV_0.GND_PWR@1(GND_PWR) STHV_0.GND_PWR@2(GND_PWR) STHV_0.GND_PWR@3(GND_PWR) STHV_0.GND_PWR@4(GND_PWR)
HVM [power]: C183.1 C184.1 C185.1 D0_1.A D1_1.A D2_1.A D3_1.A D4_1.A D5_1.A D6_1.A D7_1.A STHV_0.HVM@1(HVM) STHV_0.HVM@2(HVM) STHV_0.HVM@3(HVM) STHV_0.HVM@4(HVM) STHV_0.HVM@5(HVM)
HVM_CW [power_cw]: C190.2 C191.2 STHV_0.HVM_CW
HVP [power]: C172.2 C174.2 C175.2 D0_0.C D1_0.C D2_0.C D3_0.C D4_0.C D5_0.C D6_0.C D7_0.C STHV_0.HVP@1(HVP) STHV_0.HVP@2(HVP) STHV_0.HVP@3(HVP) STHV_0.HVP@4(HVP) STHV_0.HVP@5(HVP)
HVP_CW: C177.2 C178.2 STHV_0.HVP_CW
IN0_0: IN0_0.1(TP) STHV_0.IN1_0
IN0_1: IN0_1.1(TP) STHV_0.IN1_1
IN1_0: STHV_0.IN2_0
IN1_1: STHV_0.IN2_1
IN2_0: STHV_0.IN3_0
IN2_1: STHV_0.IN3_1
IN3_0: STHV_0.IN4_0
IN3_1: STHV_0.IN4_1
IN4_0: STHV_0.IN5_0
IN4_1: STHV_0.IN5_1
IN5_0: STHV_0.IN6_0
IN5_1: STHV_0.IN6_1
IN6_0: STHV_0.IN7_0
IN6_1: STHV_0.IN7_1
IN7_0: STHV_0.IN8_0
IN7_1: STHV_0.IN8_1
LVOUT_0 [low_voltage]: LVOUT0.1(TP) STHV_0.LVOUT_1
LVOUT_1 [low_voltage]: STHV_0.LVOUT_2
LVOUT_2 [low_voltage]: STHV_0.LVOUT_3
LVOUT_3 [low_voltage]: STHV_0.LVOUT_4
LVOUT_4 [low_voltage]: STHV_0.LVOUT_5
LVOUT_5 [low_voltage]: STHV_0.LVOUT_6
LVOUT_6 [low_voltage]: STHV_0.LVOUT_7
LVOUT_7 [low_voltage]: STHV_0.LVOUT_8
N$23: R2.1 STHV_0.THSD
N$24: C170.1 STHV_0.SUB
OUT_0: D0_0.A D0_1.C STHV_0.XDCR_1 T_OUT_0.1(TP)
OUT_1: D1_0.A D1_1.C STHV_0.XDCR_2 T_OUT_1.1(TP)
OUT_2: D2_0.A D2_1.C STHV_0.XDCR_3 T_OUT_2.1(TP)
OUT_3: D3_0.A D3_1.C STHV_0.XDCR_4 T_OUT_3.1(TP)
OUT_4: D4_0.A D4_1.C STHV_0.XDCR_5 T_OUT_4.1(TP)
OUT_5: D5_0.A D5_1.C STHV_0.XDCR_6 T_OUT_5.1(TP)
OUT_6: D6_0.A D6_1.C STHV_0.XDCR_7 T_OUT_6.1(TP)
OUT_7: D7_0.A D7_1.C STHV_0.XDCR_8 T_OUT_7.1(TP)
VDDM [power_cw]: C181.1 STHV_0.VDDM
VDDP [power_cw]: C180.1 C182.1 R2.2 STHV_0.DVDD STHV_0.VDDP ; supply symbol labelled VDD

### Notes on the sheet
- clamping circuit

### Library data of the parts
C170 C172 C174 C175 C177 C178 C180-C185 C190 C191 = rcl:C-EU: CAPACITOR, European symbol; SPICEPREFIX: C
D0_0 D0_1 D1_0 D1_1 D2_0 D2_1 D3_0 D3_1 D4_0 D4_1 D5_0 D5_1 D6_0 D6_1 D7_0 D7_1 = dfls130l-7:SBR1U200P1: Super Barrier Rectifier Diode; MF: Diodes Inc; MOUSER: SBR1U200P1-7; MPN: SBR1U200P1
GND_1 = 5019:5019: Test Point, Compact, Surface Mount; AVAILABILITY: Good; DESCRIPTION: Phosphor Bronze Contact Miniature Silver Plated Surface Mount Test Points; MF: Keystone; MP: 5019; PACKAGE: 2010 Keystone; PRICE: 0.18 USD
IN0_0 IN0_1 LVOUT0 T_OUT_0 T_OUT_1-T_OUT_7 = keystone_5015:5015: Test Point; Black; Surface Mount; Wire Leaded; Polycarbonate; 0.04 in.; AVAILABILITY: Unavailable; DESCRIPTION: Test Point; Black; Surface Mount; Wire Leaded; Polycarbonate; 0.04 in.; MF: Keystone Electronics; MP: 5015; PACKAGE: Keystone Electronics; PRICE: None
R2 = rcl:R-EU_: RESISTOR, European symbol
STHV_0 = wouter:STHV800

## Module RECEIVER
Ports: IN0(in) IN1(in) IN2(in) IN3(in) CNV(in) BUSY(out) !CS(in) SCKI(in) SDI(in) SDO0(out) SDO1(out) SDO2(out) SDO3(out)
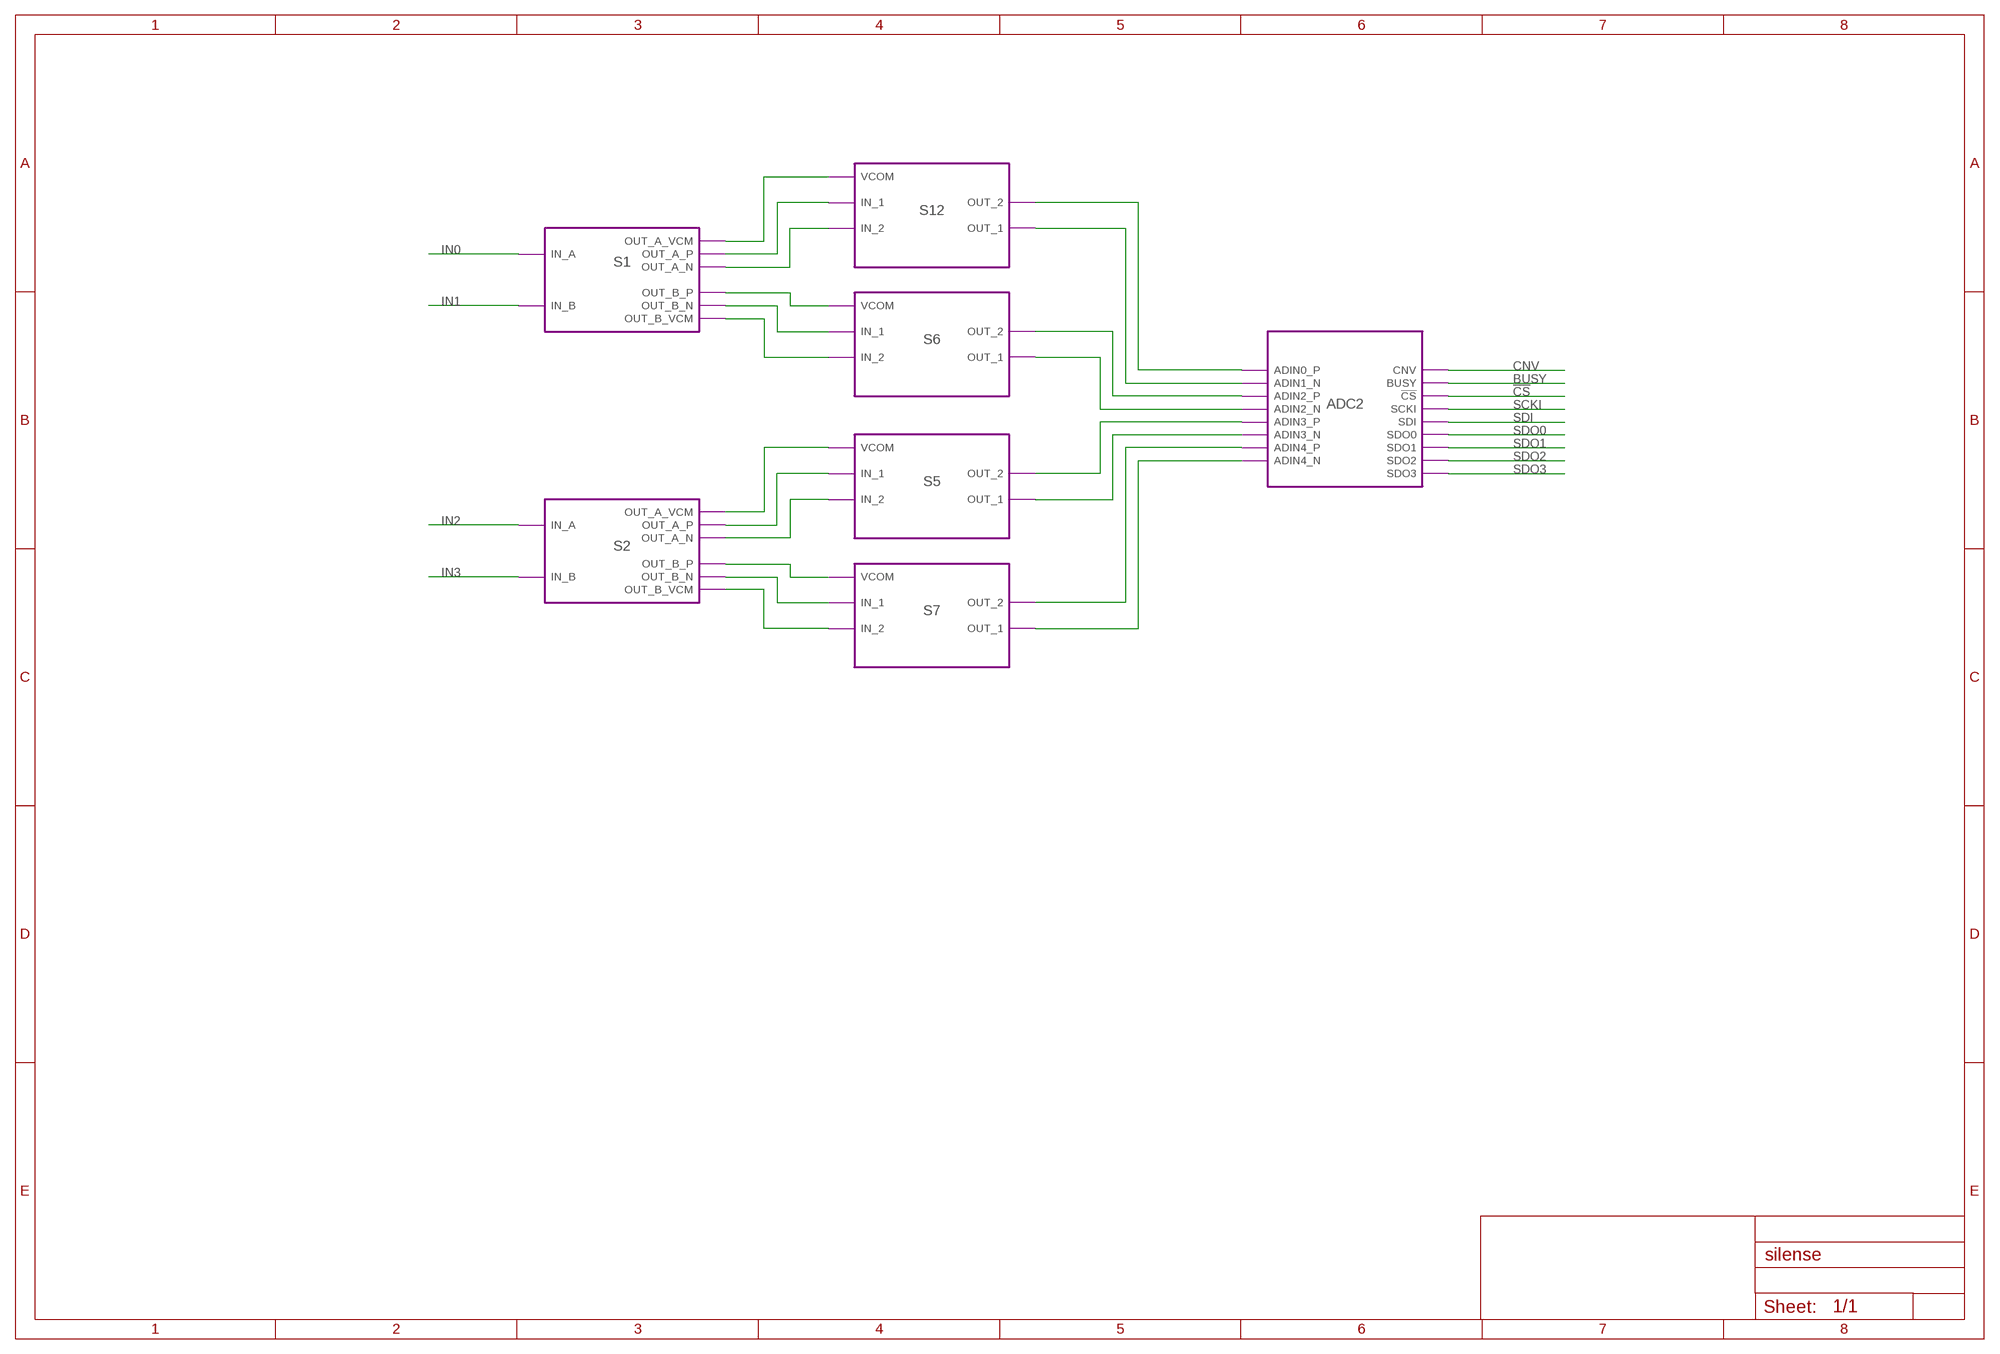
[diagram p8: schematic, module RECEIVER, sheet 1]

### Module instances
S1 = AD8334
S2 = AD8334
S5 = ENVELOPE
S6 = ENVELOPE
S7 = ENVELOPE
S12 = ENVELOPE
ADC2 = ADC

### Nets
!CS: port ADC2.!CS
BUSY: port ADC2.BUSY
CNV: port ADC2.CNV
IN0: port S1.IN_A
IN1: port S1.IN_B
IN2: port S2.IN_A
IN3: port S2.IN_B
N$1: port S1.OUT_A_N S12.IN_2
N$2: port S12.IN_1 S1.OUT_A_P
N$3: port S1.OUT_A_VCM S12.VCOM
N$4: port S1.OUT_B_P S6.VCOM
N$5: port S1.OUT_B_N S6.IN_1
N$6: port S1.OUT_B_VCM S6.IN_2
N$7: port S5.VCOM S2.OUT_A_VCM
N$8: port S2.OUT_A_P S5.IN_1
N$9: port S5.IN_2 S2.OUT_A_N
N$10: port S2.OUT_B_P S7.VCOM
N$11: port S2.OUT_B_N S7.IN_1
N$12: port S7.IN_2 S2.OUT_B_VCM
N$13: port ADC2.ADIN0_P S12.OUT_2
N$14: port S12.OUT_1 ADC2.ADIN1_N
N$15: port ADC2.ADIN2_P S6.OUT_2
N$16: port S6.OUT_1 ADC2.ADIN2_N
N$17: port ADC2.ADIN3_P S5.OUT_2
N$18: port S5.OUT_1 ADC2.ADIN3_N
N$19: port ADC2.ADIN4_P S7.OUT_2
N$20: port S7.OUT_1 ADC2.ADIN4_N
SCKI: port ADC2.SCKI
SDI: port ADC2.SDI
SDO0: port ADC2.SDO0
SDO1: port ADC2.SDO1
SDO2: port ADC2.SDO2
SDO3: port ADC2.SDO3

### Library data of the parts

## Module CONN_RESONATORS
Ports: OUT_0(io) OUT_1(io) OUT_2(io) OUT_3(io) OUT_4(io) OUT_5(io) OUT_6(io) OUT_7(io) OUT_8(io) OUT_9(io) OUT_10(io) OUT_11(io) OUT_12(io) OUT_13(io) OUT_14(io) OUT_15(io)
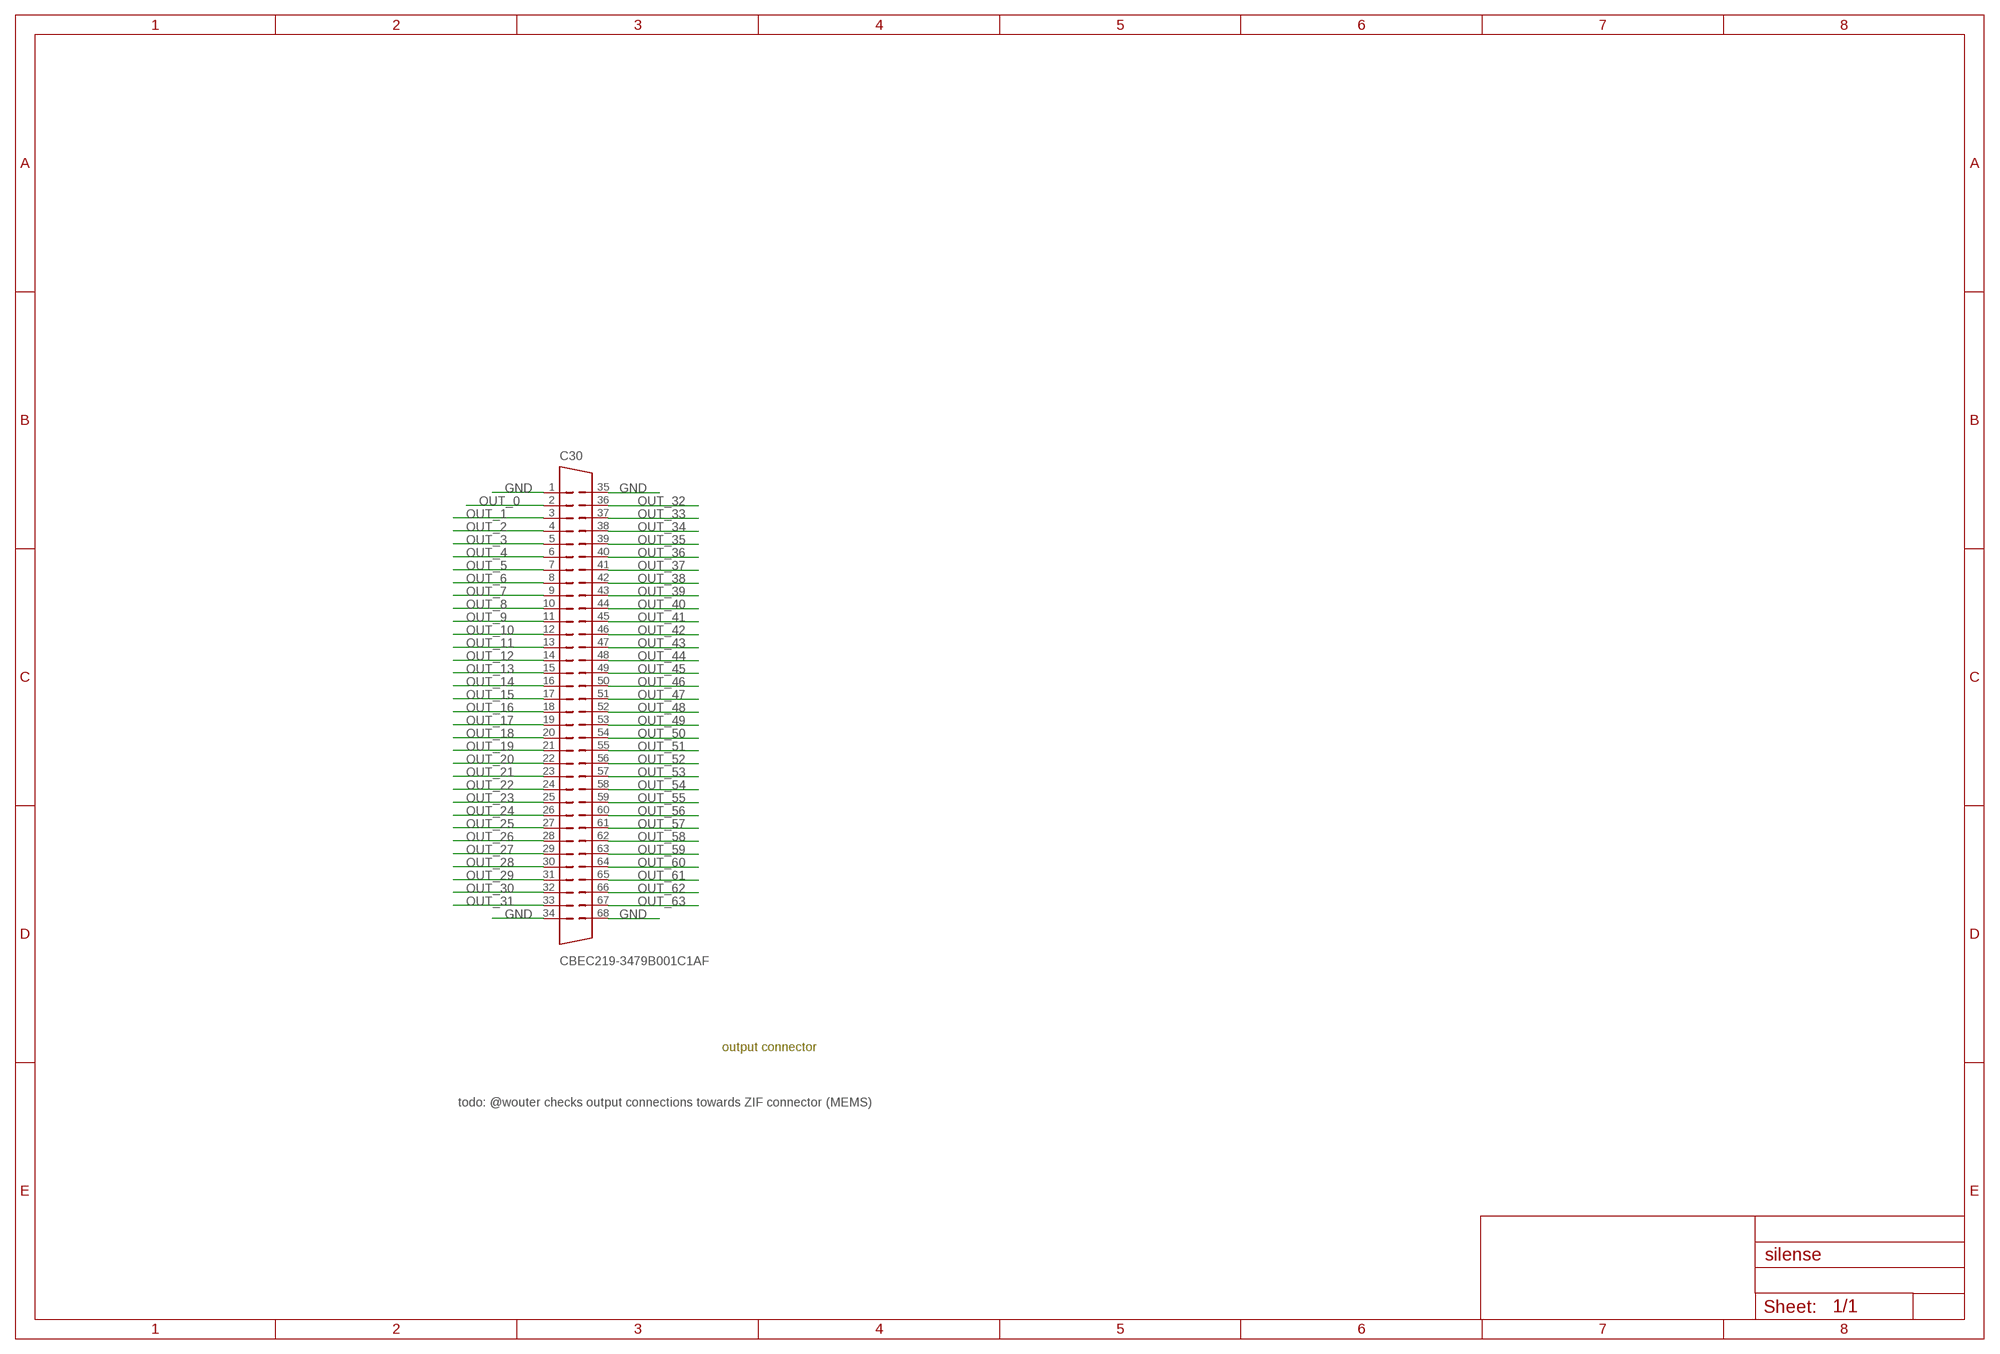
[diagram p9: schematic, module CONN_RESONATORS, sheet 1]

### Parts
C30  CBEC219-3479B001C1AF  [BTB_CONN_68_F]

### Nets
GND [power]: C30.1 C30.34 C30.35 C30.68
OUT_0: C30.2
OUT_1: C30.3
OUT_2: C30.4
OUT_3: C30.5
OUT_4: C30.6
OUT_5: C30.7
OUT_6: C30.8
OUT_7: C30.9
OUT_8: C30.10
OUT_9: C30.11
OUT_10: C30.12
OUT_11: C30.13
OUT_12: C30.14
OUT_13: C30.15
OUT_14: C30.16
OUT_15: C30.17
OUT_16: C30.18
OUT_17: C30.19
OUT_18: C30.20
OUT_19: C30.21
OUT_20: C30.22
OUT_21: C30.23
OUT_22: C30.24
OUT_23: C30.25
OUT_24: C30.26
OUT_25: C30.27
OUT_26: C30.28
OUT_27: C30.29
OUT_28: C30.30
OUT_29: C30.31
OUT_30: C30.32
OUT_31: C30.33
OUT_32: C30.36
OUT_33: C30.37
OUT_34: C30.38
OUT_35: C30.39
OUT_36: C30.40
OUT_37: C30.41
OUT_38: C30.42
OUT_39: C30.43
OUT_40: C30.44
OUT_41: C30.45
OUT_42: C30.46
OUT_43: C30.47
OUT_44: C30.48
OUT_45: C30.49
OUT_46: C30.50
OUT_47: C30.51
OUT_48: C30.52
OUT_49: C30.53
OUT_50: C30.54
OUT_51: C30.55
OUT_52: C30.56
OUT_53: C30.57
OUT_54: C30.58
OUT_55: C30.59
OUT_56: C30.60
OUT_57: C30.61
OUT_58: C30.62
OUT_59: C30.63
OUT_60: C30.64
OUT_61: C30.65
OUT_62: C30.66
OUT_63: C30.67

### Notes on the sheet
- output connector
- todo: @wouter checks output connections towards ZIF connector (MEMS)

### Library data of the parts
C30 = wouter:CBEC219-3479B001C1AF: Board-to-board connector, 1.27mm pitch, 68 contacts, receptable, CBEC219 series, Surface mounts, 2 rows; FARNELL: 2784008; MFR: GREENCONN CBEC219-3479B001C1AF

## Net classes
1 power_cw: width 0.2 mm
2 power: width 0.3 mm